# EAGLE design Robot (EAGLE 7.4.0)
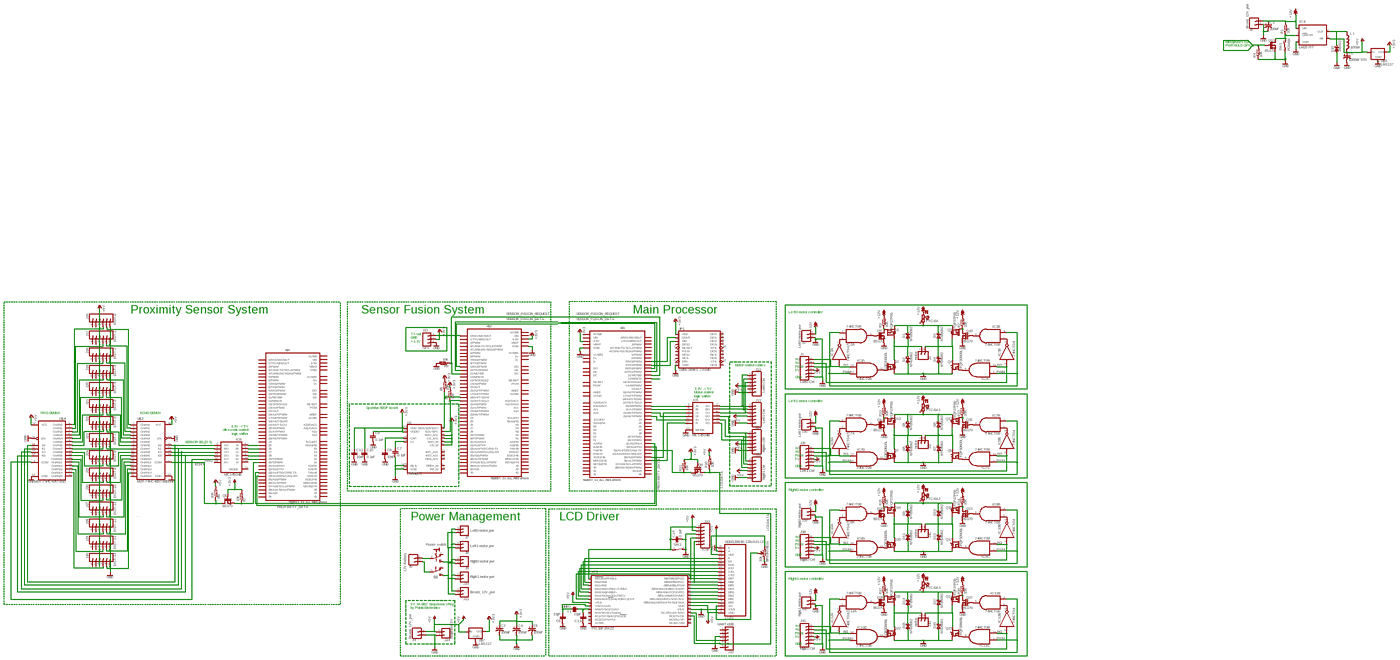
[diagram p0: schematic, sheet 1, overview]
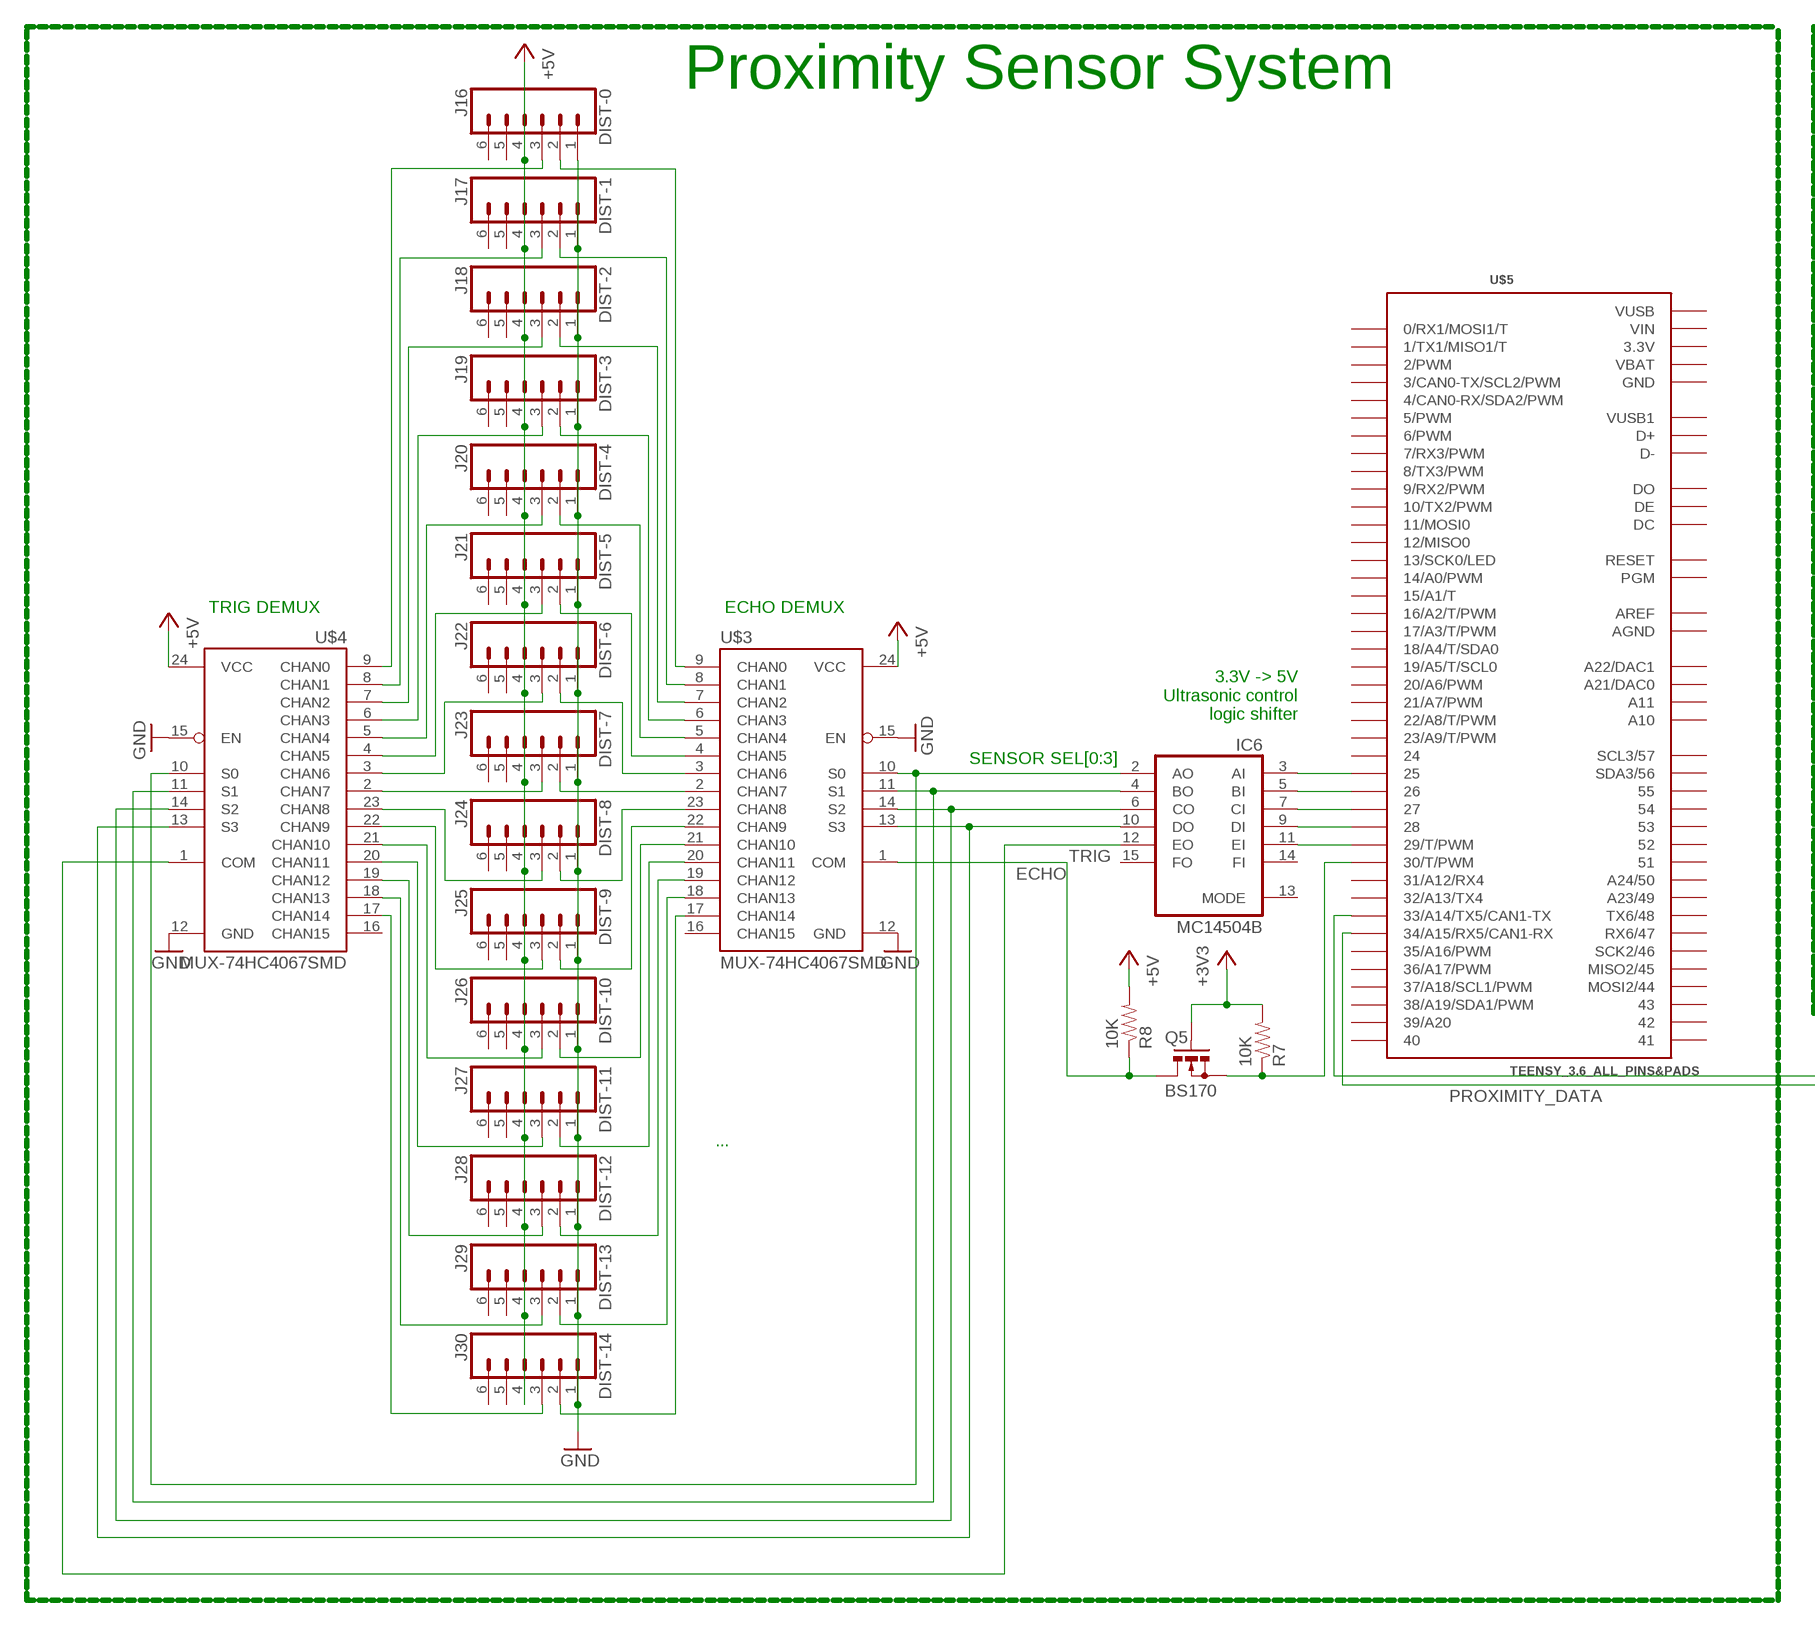
[diagram p1: schematic, sheet 1, part 1 of 4]
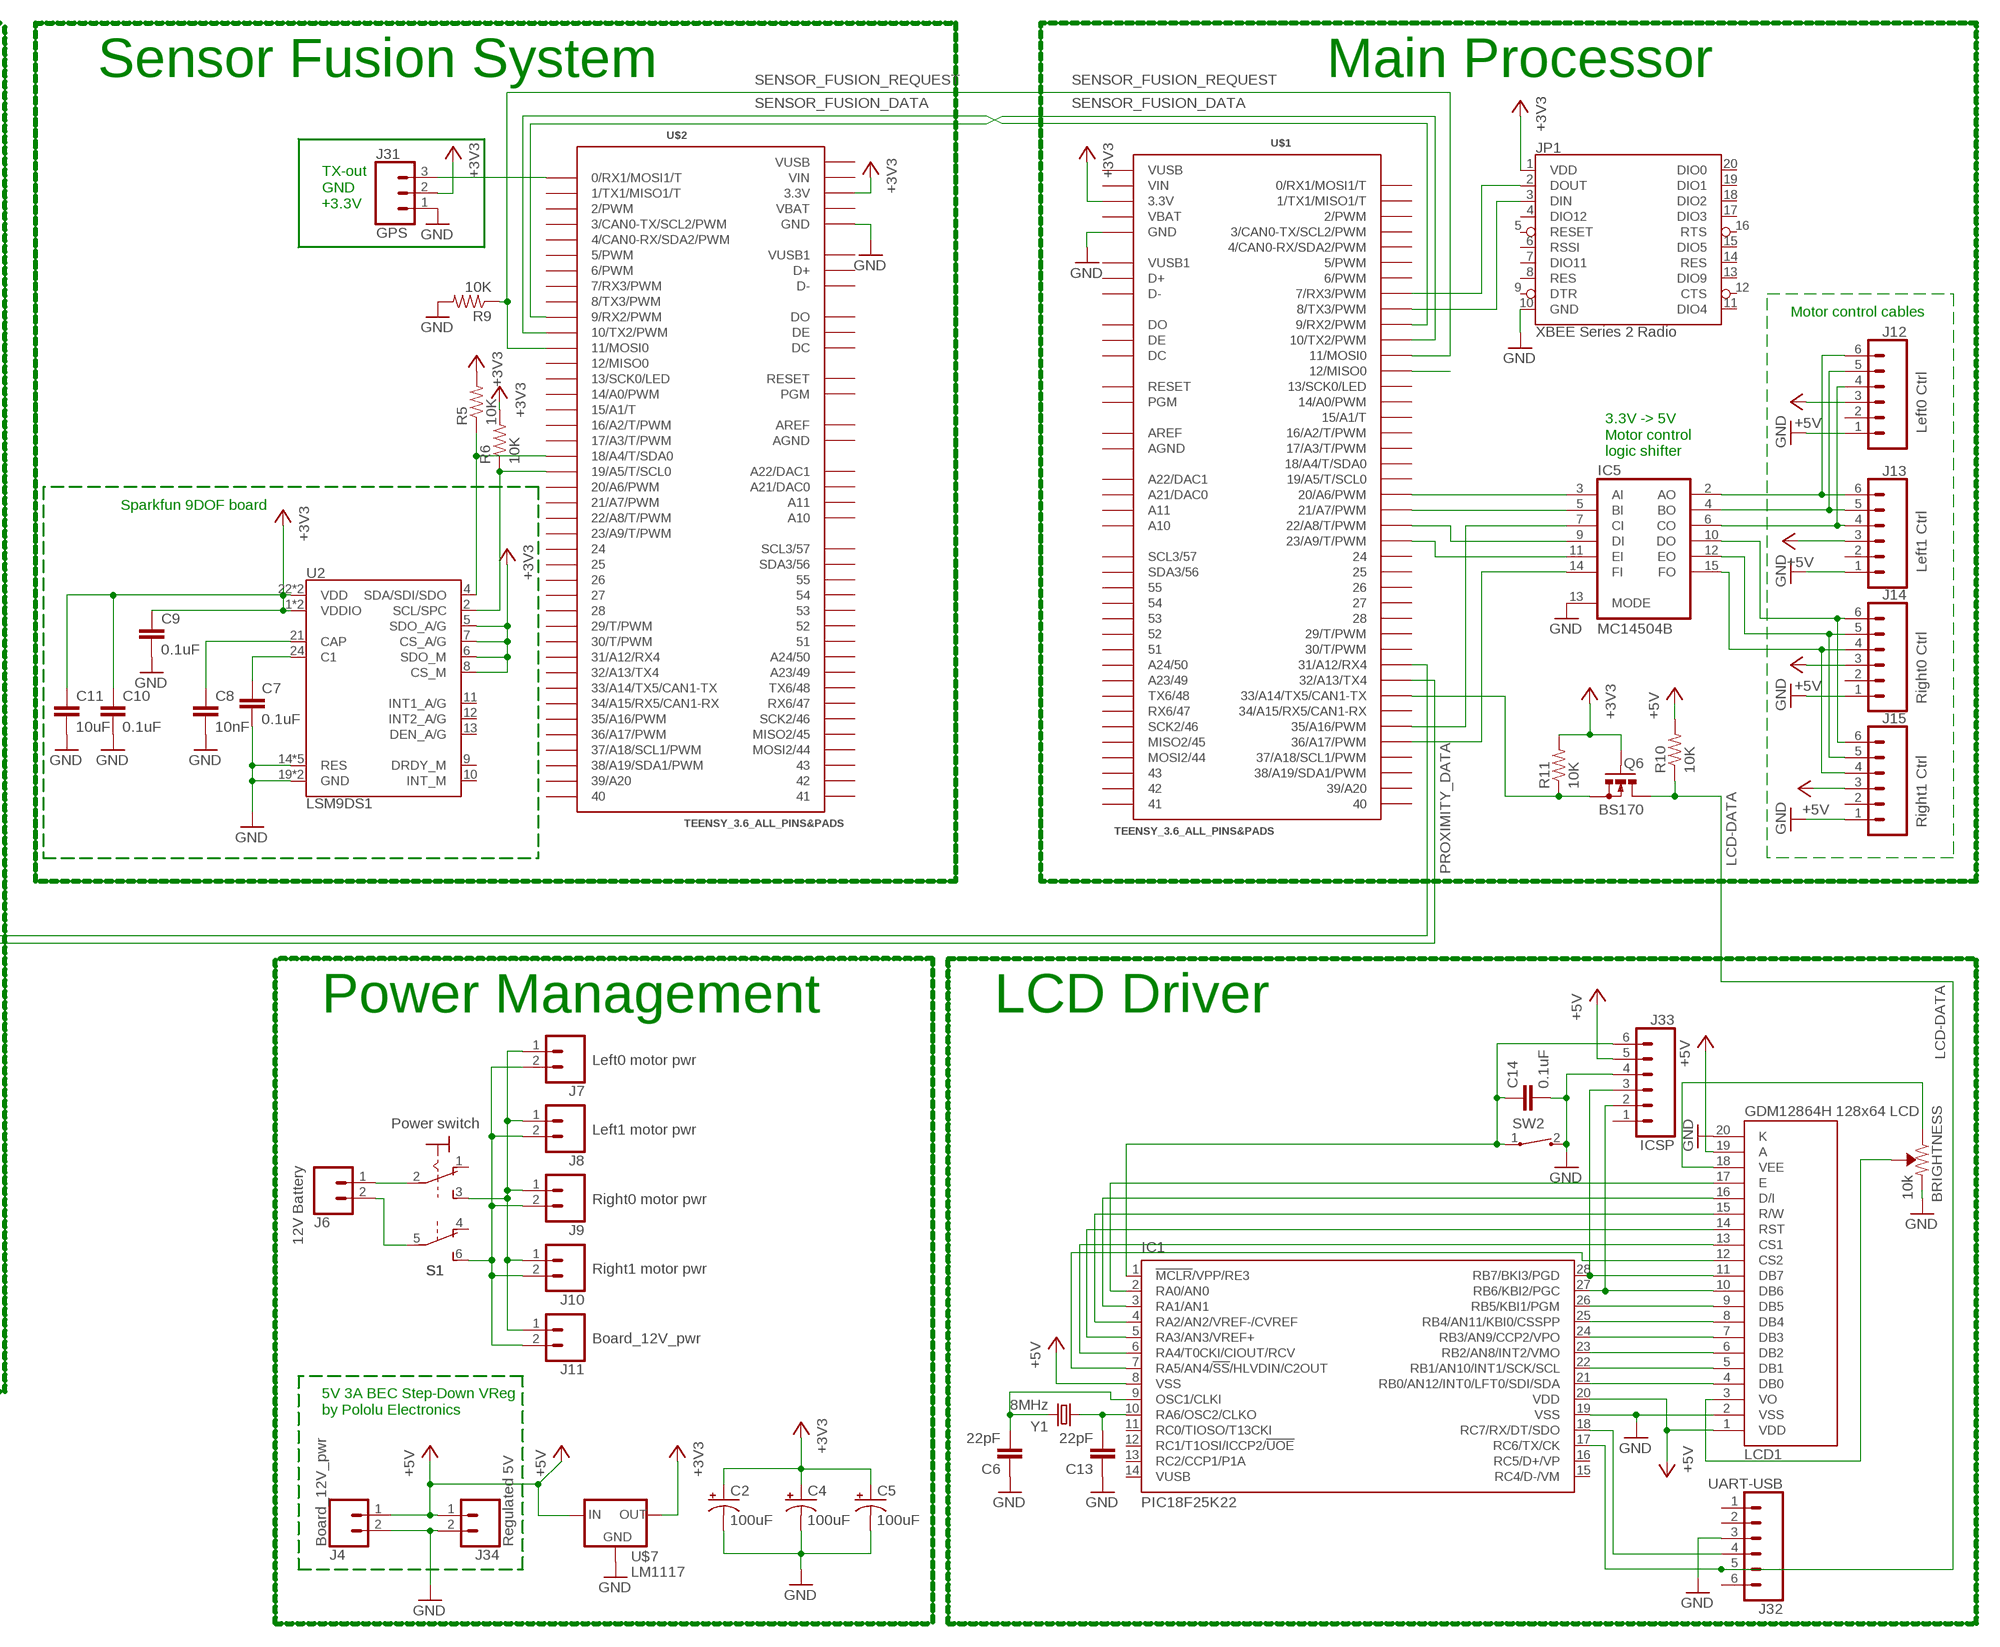
[diagram p2: schematic, sheet 1, part 2 of 4]
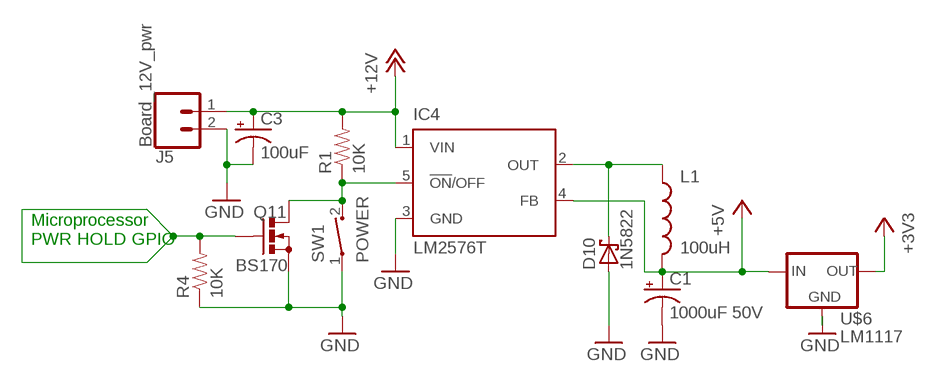
[diagram p3: schematic, sheet 1, part 3 of 4]
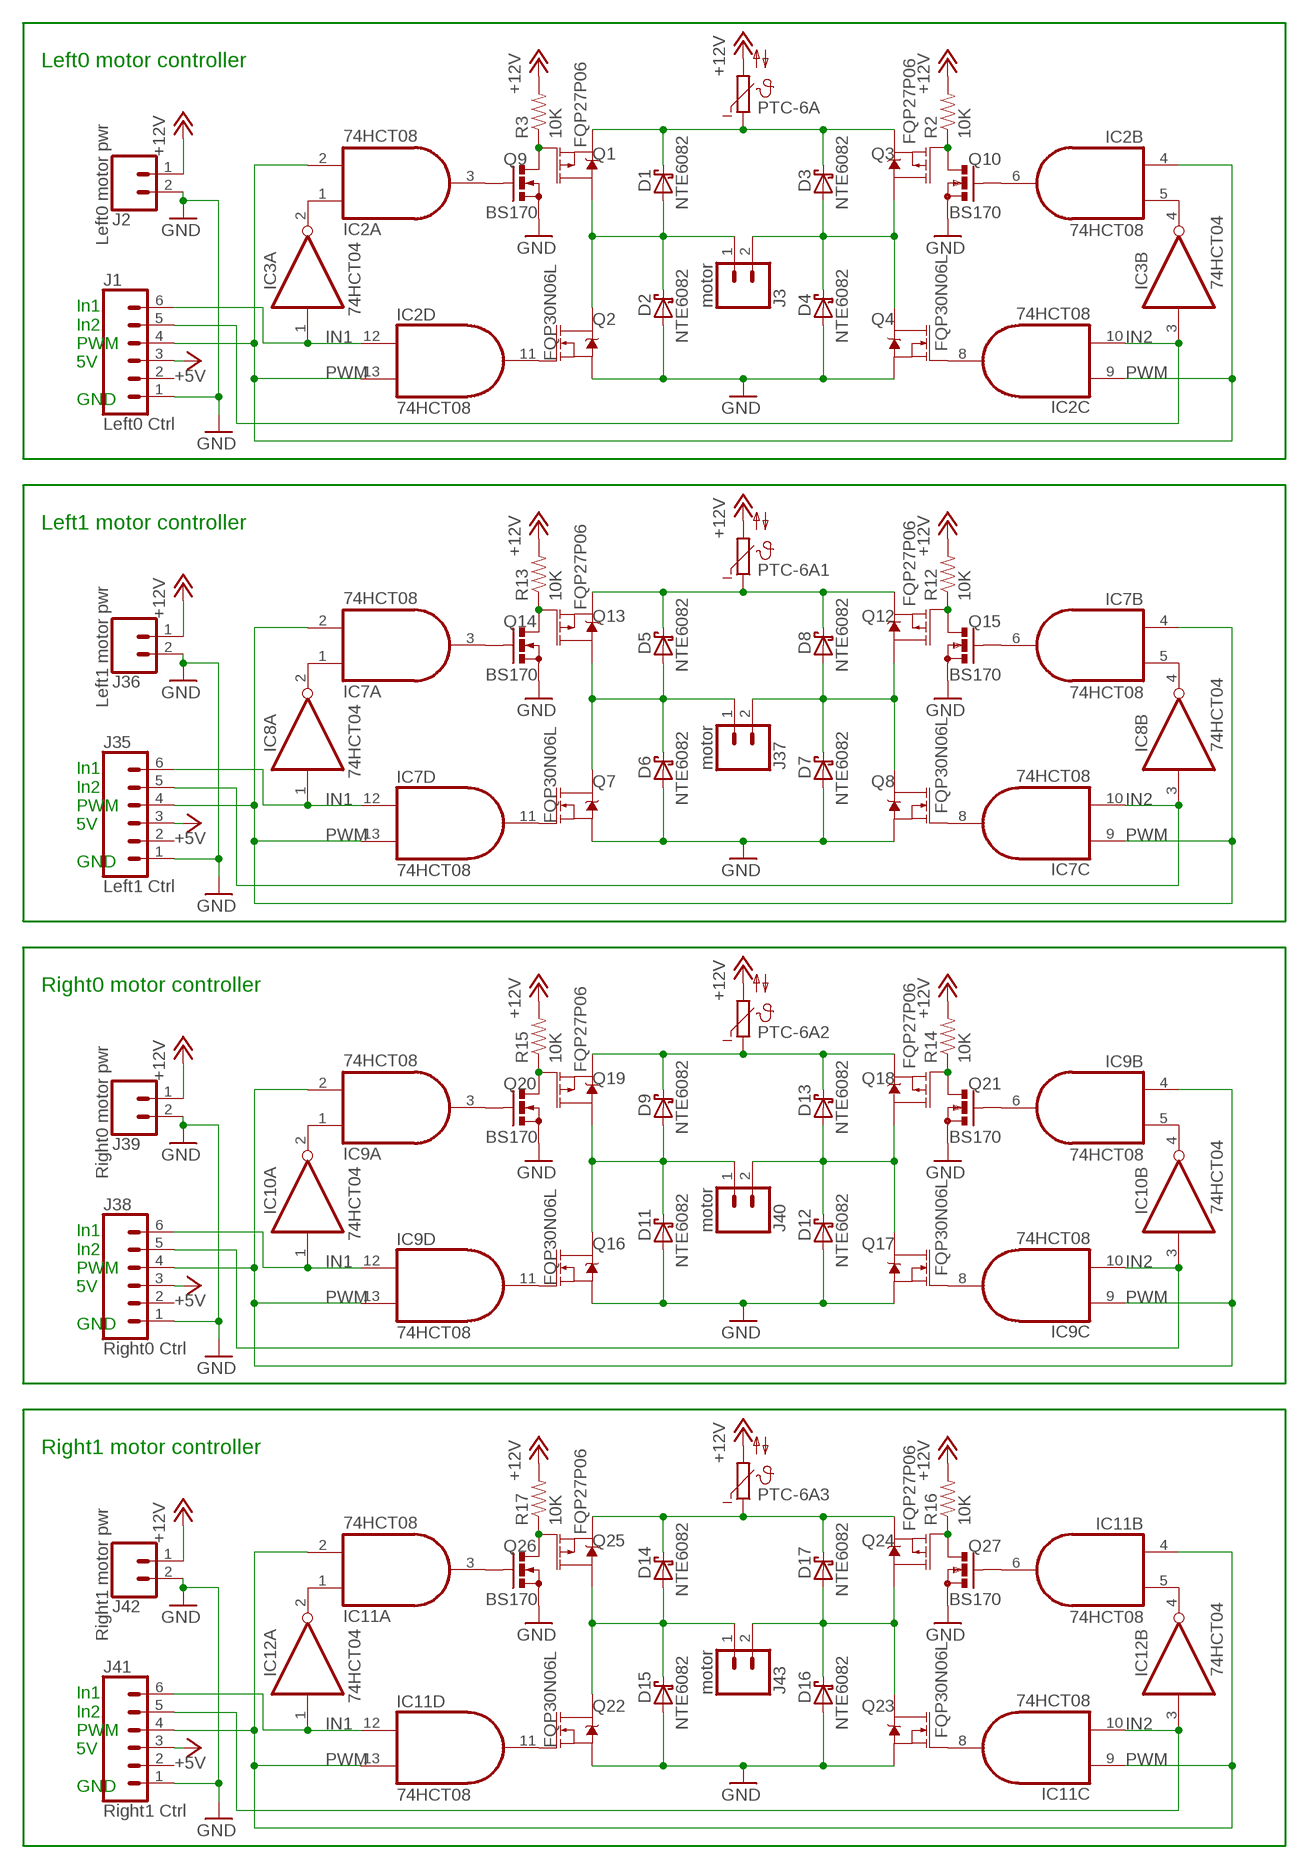
[diagram p4: schematic, sheet 1, part 4 of 4]

## Parts
BRIGHTNESS  10k  TRIMPOT-PTH-10MM-KNOB-1/2W-10%  [TRIMPOT-PTH-3386U]
C1  1000uF 50V  1000UF-RADIAL-5MM-35V-20%-KIT  [CPOL-RADIAL-5MM-10MM-KIT]
C2  100uF  100UF-POLAR-RADIAL-2.5MM-25V-20%  [CPOL-RADIAL-2.5MM-6.5MM]
C3  100uF  100UF-POLAR-RADIAL-2.5MM-25V-20%  [CPOL-RADIAL-2.5MM-6.5MM]
C4  100uF  100UF-POLAR-RADIAL-2.5MM-25V-20%  [CPOL-RADIAL-2.5MM-6.5MM]
C5  100uF  100UF-POLAR-RADIAL-2.5MM-25V-20%  [CPOL-RADIAL-2.5MM-6.5MM]
C6  22pF  CAPEZ  [CAP-PTH-SMALLEZ]
C7  0.1uF  CAPEZ  [CAP-PTH-SMALLEZ]
C8  10nF  CAPEZ  [CAP-PTH-SMALLEZ]
C9  0.1uF  CAPEZ  [CAP-PTH-SMALLEZ]
C10  0.1uF  CAPEZ  [CAP-PTH-SMALLEZ]
C11  10uF  CAPEZ  [CAP-PTH-SMALLEZ]
C13  22pF  CAPEZ  [CAP-PTH-SMALLEZ]
C14  0.1uF  CAPEZ  [CAP-PTH-SMALLEZ]
D1  NTE6082  FES08AT  [DO220S]
D2  NTE6082  FES08AT  [DO220S]
D3  NTE6082  FES08AT  [DO220S]
D4  NTE6082  FES08AT  [DO220S]
D5  NTE6082  FES08AT  [DO220S]
D6  NTE6082  FES08AT  [DO220S]
D7  NTE6082  FES08AT  [DO220S]
D8  NTE6082  FES08AT  [DO220S]
D9  NTE6082  FES08AT  [DO220S]
D10  1N5822  1N5908  [C4111-15]
D11  NTE6082  FES08AT  [DO220S]
D12  NTE6082  FES08AT  [DO220S]
D13  NTE6082  FES08AT  [DO220S]
D14  NTE6082  FES08AT  [DO220S]
D15  NTE6082  FES08AT  [DO220S]
D16  NTE6082  FES08AT  [DO220S]
D17  NTE6082  FES08AT  [DO220S]
IC1  PIC18F25K22  PIC18F2550_28DIP  [DIL28-3]
IC2  74HCT08  74ALS08N  [DIL14]
IC3  74HCT04  74ALS04N  [DIL14]
IC4  LM2576T  LM2596T  [T05D]
IC5  MC14504B  4504N  [DIL16]
IC6  MC14504B  4504N  [DIL16]
IC7  74HCT08  74ALS08N  [DIL14]
IC8  74HCT04  74ALS04N  [DIL14]
IC9  74HCT08  74ALS08N  [DIL14]
IC10  74HCT04  74ALS04N  [DIL14]
IC11  74HCT08  74ALS08N  [DIL14]
IC12  74HCT04  74ALS04N  [DIL14]
J1  Left0 Ctrl  CONN_06POLAR  [MOLEX-1X6]
J2  Left0 motor pwr  CONN_023.5MM  [SCREWTERMINAL-3.5MM-2]
J3  motor  CONN_023.5MM  [SCREWTERMINAL-3.5MM-2]
J4  Board_12V_pwr  CONN_023.5MM  [SCREWTERMINAL-3.5MM-2]
J5  Board_12V_pwr  CONN_023.5MM  [SCREWTERMINAL-3.5MM-2]
J6  12V Battery  CONN_023.5MM  [SCREWTERMINAL-3.5MM-2]
J7  Left0 motor pwr  CONN_023.5MM  [SCREWTERMINAL-3.5MM-2]
J8  Left1 motor pwr  CONN_023.5MM  [SCREWTERMINAL-3.5MM-2]
J9  Right0 motor pwr  CONN_023.5MM  [SCREWTERMINAL-3.5MM-2]
J10  Right1 motor pwr  CONN_023.5MM  [SCREWTERMINAL-3.5MM-2]
J11  Board_12V_pwr  CONN_023.5MM  [SCREWTERMINAL-3.5MM-2]
J12  Left0 Ctrl  CONN_06POLAR  [MOLEX-1X6]
J13  Left1 Ctrl  CONN_06POLAR  [MOLEX-1X6]
J14  Right0 Ctrl  CONN_06POLAR  [MOLEX-1X6]
J15  Right1 Ctrl  CONN_06POLAR  [MOLEX-1X6]
J16  DIST-0  CONN_06POLAR  [MOLEX-1X6]
J17  DIST-1  CONN_06POLAR  [MOLEX-1X6]
J18  DIST-2  CONN_06POLAR  [MOLEX-1X6]
J19  DIST-3  CONN_06POLAR  [MOLEX-1X6]
J20  DIST-4  CONN_06POLAR  [MOLEX-1X6]
J21  DIST-5  CONN_06POLAR  [MOLEX-1X6]
J22  DIST-6  CONN_06POLAR  [MOLEX-1X6]
J23  DIST-7  CONN_06POLAR  [MOLEX-1X6]
J24  DIST-8  CONN_06POLAR  [MOLEX-1X6]
J25  DIST-9  CONN_06POLAR  [MOLEX-1X6]
J26  DIST-10  CONN_06POLAR  [MOLEX-1X6]
J27  DIST-11  CONN_06POLAR  [MOLEX-1X6]
J28  DIST-12  CONN_06POLAR  [MOLEX-1X6]
J29  DIST-13  CONN_06POLAR  [MOLEX-1X6]
J30  DIST-14  CONN_06POLAR  [MOLEX-1X6]
J31  GPS  CONN_03  [1X03]
J32  UART-USB  CONN_06POLAR  [MOLEX-1X6]
J33  ICSP  CONN_06POLAR  [MOLEX-1X6]
J34  Regulated 5V  CONN_023.5MM  [SCREWTERMINAL-3.5MM-2]
J35  Left1 Ctrl  CONN_06POLAR  [MOLEX-1X6]
J36  Left1 motor pwr  CONN_023.5MM  [SCREWTERMINAL-3.5MM-2]
J37  motor  CONN_023.5MM  [SCREWTERMINAL-3.5MM-2]
J38  Right0 Ctrl  CONN_06POLAR  [MOLEX-1X6]
J39  Right0 motor pwr  CONN_023.5MM  [SCREWTERMINAL-3.5MM-2]
J40  motor  CONN_023.5MM  [SCREWTERMINAL-3.5MM-2]
J41  Right1 Ctrl  CONN_06POLAR  [MOLEX-1X6]
J42  Right1 motor pwr  CONN_023.5MM  [SCREWTERMINAL-3.5MM-2]
J43  motor  CONN_023.5MM  [SCREWTERMINAL-3.5MM-2]
JP1  XBEE Series 2 Radio  XBEE  [XBEE]
L1  100uH  INDUCTORAXIAL-0.6  [AXIAL-0.6]
LCD1  GDM12864H 128x64 LCD  LCD-G12864-FULL  [LCD-G12864]
PTC-6A  NTC644A  [N644A]
PTC-6A1  NTC644A  [N644A]
PTC-6A2  NTC644A  [N644A]
PTC-6A3  NTC644A  [N644A]
Q1  FQP27P06  MOSFET_PCH-NDP6020P  [TO220V]
Q2  FQP30N06L  MOSFET-NCH-FQP30N06L  [TO220V]
Q3  FQP27P06  MOSFET_PCH-NDP6020P  [TO220V]
Q4  FQP30N06L  MOSFET-NCH-FQP30N06L  [TO220V]
Q5  BS170  [SOT54E]
Q6  BS170  [SOT54E]
Q7  FQP30N06L  MOSFET-NCH-FQP30N06L  [TO220V]
Q8  FQP30N06L  MOSFET-NCH-FQP30N06L  [TO220V]
Q9  BS170  [SOT54E]
Q10  BS170  [SOT54E]
Q11  BS170  [SOT54E]
Q12  FQP27P06  MOSFET_PCH-NDP6020P  [TO220V]
Q13  FQP27P06  MOSFET_PCH-NDP6020P  [TO220V]
Q14  BS170  [SOT54E]
Q15  BS170  [SOT54E]
Q16  FQP30N06L  MOSFET-NCH-FQP30N06L  [TO220V]
Q17  FQP30N06L  MOSFET-NCH-FQP30N06L  [TO220V]
Q18  FQP27P06  MOSFET_PCH-NDP6020P  [TO220V]
Q19  FQP27P06  MOSFET_PCH-NDP6020P  [TO220V]
Q20  BS170  [SOT54E]
Q21  BS170  [SOT54E]
Q22  FQP30N06L  MOSFET-NCH-FQP30N06L  [TO220V]
Q23  FQP30N06L  MOSFET-NCH-FQP30N06L  [TO220V]
Q24  FQP27P06  MOSFET_PCH-NDP6020P  [TO220V]
Q25  FQP27P06  MOSFET_PCH-NDP6020P  [TO220V]
Q26  BS170  [SOT54E]
Q27  BS170  [SOT54E]
R1  10K  RESISTORPTH-1/4W  [AXIAL-0.4]
R2  10K  RESISTORPTH-1/4W  [AXIAL-0.4]
R3  10K  RESISTORPTH-1/4W  [AXIAL-0.4]
R4  10K  RESISTORPTH-1/4W  [AXIAL-0.4]
R5  10K  RESISTORPTH-1/4W  [AXIAL-0.4]
R6  10K  RESISTORPTH-1/4W  [AXIAL-0.4]
R7  10K  RESISTORPTH-1/4W  [AXIAL-0.4]
R8  10K  RESISTORPTH-1/4W  [AXIAL-0.4]
R9  10K  RESISTORPTH-1/4W  [AXIAL-0.4]
R10  10K  RESISTORPTH-1/4W  [AXIAL-0.4]
R11  10K  RESISTORPTH-1/4W  [AXIAL-0.4]
R12  10K  RESISTORPTH-1/4W  [AXIAL-0.4]
R13  10K  RESISTORPTH-1/4W  [AXIAL-0.4]
R14  10K  RESISTORPTH-1/4W  [AXIAL-0.4]
R15  10K  RESISTORPTH-1/4W  [AXIAL-0.4]
R16  10K  RESISTORPTH-1/4W  [AXIAL-0.4]
R17  10K  RESISTORPTH-1/4W  [AXIAL-0.4]
S1  Power switch  M9040P2  [M9040P2]
SW1  POWER  CT10-XXXX-A2  [CT10-XXXX-A2]
SW2  CT10-XXXX-A2  [CT10-XXXX-A2]
U2  LSM9DS1  [LGA-24-3.5X3]
U$1  TEENSY_3.6_ALL_PINS&PADS  [TEENSY_3.6_ALL_PINS&PADS]
U$2  TEENSY_3.6_ALL_PINS&PADS  [TEENSY_3.6_ALL_PINS&PADS]
U$3  MUX-74HC4067SMD  [SSOP24]
U$4  MUX-74HC4067SMD  [SSOP24]
U$5  TEENSY_3.6_ALL_PINS&PADS  [TEENSY_3.6_ALL_PINS&PADS]
U$6  LM1117  V_REG_LD1117VXX  [78XXL]
U$7  LM1117  V_REG_LD1117VXX  [78XXL]
Y1  8MHz  CRYSTALHC49UV  [HC49U-V]

## Nets
+3V3: C2.1(+) C4.1(+) C5.1(+) C9.1 C10.1 C11.1 J31.2 JP1.1(VDD) Q5.G Q6.G R5.P$2 R6.P$2 R7.P$2 R11.P$2 U2.1(VDDIO) U2.3(VDDIO) U2.5(SDO_A/G) U2.6(SDO_M) U2.7(CS_A/G) U2.8(CS_M) U2.22(VDD) U2.23(VDD) U$1.3.3V U$1.3.3V2(3.3V) U$1.3.3V3(3.3V) U$1.3.3V4(3.3V) U$2.3.3V U$2.3.3V2(3.3V) U$2.3.3V3(3.3V) U$2.3.3V4(3.3V) U$6.GND(OUT) U$7.GND(OUT)
+5V: C1.+ IC1.8(VSS) IC1.20(VDD) IC4.4(FB) J1.3 J4.1 J12.3 J13.3 J14.3 J15.3 J16.4 J17.4 J18.4 J19.4 J20.4 J21.4 J22.4 J23.4 J24.4 J25.4 J26.4 J27.4 J28.4 J29.4 J30.4 J33.5 J34.1 J35.3 J38.3 J41.3 L1.P$2 LCD1.1(VDD) LCD1.19(A) R8.P$2 R10.P$2 U$3.24(VCC) U$4.24(VCC) U$6.OUT(IN) U$7.OUT(IN)
+12V: C3.1(+) IC4.1(VIN) J2.1 J5.1 J36.1 J39.1 J42.1 PTC-6A1.2 PTC-6A2.2 PTC-6A3.2 PTC-6A.2 R1.P$2 R2.P$2 R3.P$2 R12.P$2 R13.P$2 R14.P$2 R15.P$2 R16.P$2 R17.P$2
ECHO: Q5.D R8.P$1 U$3.1(COM)
GND: BRIGHTNESS.1(CCW) C1.- C2.2(-) C3.2(-) C4.2(-) C5.2(-) C6.1 C7.2 C8.2 C9.2 C10.2 C11.2 C13.1 C14.2 D10.A IC1.19(VSS) IC4.3(GND) IC5.13(MODE) J1.1 J2.2 J4.2 J5.2 J12.1 J13.1 J14.1 J15.1 J16.1 J17.1 J18.1 J19.1 J20.1 J21.1 J22.1 J23.1 J24.1 J25.1 J26.1 J27.1 J28.1 J29.1 J30.1 J31.1 J32.3 J33.4 J34.2 J35.1 J36.2 J38.1 J39.2 J41.1 J42.2 JP1.10(GND) LCD1.2(VSS) LCD1.20(K) Q9.S Q10.S Q11.S Q14.S Q15.S Q20.S Q21.S Q26.S Q27.S R4.P$1 R9.P$2 SW1.1 SW2.2 U2.14(RES) U2.15(RES) U2.16(RES) U2.17(RES) U2.18(RES) U2.19(GND) U2.20(GND) U$1.GND U$1.GND1(GND) U$1.GND2(GND) U$1.GND3(GND) U$1.GND4(GND) U$1.GND5(GND) U$1.GND6(GND) U$2.GND U$2.GND1(GND) U$2.GND2(GND) U$2.GND3(GND) U$2.GND4(GND) U$2.GND5(GND) U$2.GND6(GND) U$3.12(GND) U$3.15(EN) U$4.12(GND) U$4.15(EN) U$6.IN(GND) U$7.IN(GND)
IN1: IC2.12(D:I0) IC3.1(A:I) IC7.12(D:I0) IC8.1(A:I) IC9.12(D:I0) IC10.1(A:I) IC11.12(D:I0) IC12.1(A:I) J1.6 J35.6 J38.6 J41.6
IN2: IC2.10(C:I1) IC3.3(B:I) IC7.10(C:I1) IC8.3(B:I) IC9.10(C:I1) IC10.3(B:I) IC11.10(C:I1) IC12.3(B:I) J1.5 J35.5 J38.5 J41.5
LCD-DATA: IC1.17(RC6/TX/CK) J32.5 Q6.D R10.P$1
N$1: IC2.3(A:O) Q9.G
N$2: IC2.6(B:O) Q10.G
N$3: Q6.S R11.P$1 U$1.33/A14(33/A14/TX5/CAN1-TX)
N$4: IC5.11(EI) U$1.23/A9(23/A9/T/PWM)
N$6: Q11.G R4.P$2
N$7: IC5.9(DI) U$1.22/A8(22/A8/T/PWM)
N$8: J19.2 U$3.6(CHAN3)
N$9: IC4.5(!ON!/OFF) Q11.D R1.P$1 SW1.2
N$10: U$1.12(12/MISO0)
N$11: D10.C IC4.2(OUT) L1.P$1
N$12: JP1.2(DOUT) U$1.7(7/RX3/PWM)
N$13: R6.P$1 U2.2(SCL/SPC) U$2.19/A5(19/A5/T/SCL0)
N$14: R5.P$1 U2.4(SDA/SDI/SDO) U$2.18/A4(18/A4/T/SDA0)
N$15: J31.3 U$2.0(0/RX1/MOSI1/T)
N$16: IC5.3(AI) U$1.20/A6(20/A6/PWM)
N$18: J6.1 S1.2(1:P)
N$19: J6.2 S1.5(2:P)
N$20: J7.1 J8.1 J9.1 J10.1 J11.1 S1.3(1:S)
N$21: IC5.2(AO) J12.6 J13.6
N$22: IC1.2(RA0/AN0) LCD1.17(E)
N$23: IC1.3(RA1/AN1) LCD1.16(D/I)
N$24: IC1.5(RA3/AN3/VREF+) LCD1.14(RST)
N$25: IC1.21(RB0/AN12/INT0/LFT0/SDI/SDA) LCD1.4(DB0)
N$26: IC1.22(RB1/AN10/INT1/SCK/SCL) LCD1.5(DB1)
N$27: IC1.23(RB2/AN8/INT2/VMO) LCD1.6(DB2)
N$28: IC1.24(RB3/AN9/CCP2/VPO) LCD1.7(DB3)
N$29: IC1.25(RB4/AN11/KBI0/CSSPP) LCD1.8(DB4)
N$30: IC1.26(RB5/KBI1/PGM) LCD1.9(DB5)
N$31: IC1.27(RB6/KBI2/PGC) J33.2 LCD1.10(DB6)
N$32: IC1.28(RB7/BKI3/PGD) J33.3 LCD1.11(DB7)
N$33: IC1.4(RA2/AN2/VREF-/CVREF) LCD1.15(R/W)
N$34: IC1.6(RA4/T0CKI/CIOUT/RCV) LCD1.13(CS1)
N$35: IC1.7(RA5/AN4/!SS!/HLVDIN/C2OUT) LCD1.12(CS2)
N$36: D1.A D2.C J3.1 Q1.2(D) Q2.2(D)
N$37: D3.A D4.C J3.2 Q3.2(D) Q4.2(D)
N$38: D1.C D3.C PTC-6A.1 Q1.3(S) Q3.3(S)
N$39: IC2.11(D:O) Q2.1(G)
N$40: Q3.1(G) Q10.D R2.P$1
N$41: D2.A D4.A D6.A D7.A D11.A D12.A D15.A D16.A Q2.3(S) Q4.3(S) Q7.3(S) Q8.3(S) Q16.3(S) Q17.3(S) Q22.3(S) Q23.3(S) ; supply symbol labelled GND
N$42: IC2.8(C:O) Q4.1(G)
N$43: Q1.1(G) Q9.D R3.P$1
N$44: J7.2 J8.2 J9.2 J10.2 J11.2 S1.6(2:S)
N$45: BRIGHTNESS.2(WIPER) LCD1.3(VO)
N$46: JP1.3(DIN) U$1.8(8/TX3/PWM)
N$47: BRIGHTNESS.3(CW) LCD1.18(VEE)
N$48: IC5.4(BO) J12.5 J13.5
N$49: D5.A D6.C J37.1 Q7.2(D) Q13.2(D)
N$50: IC2.1(A:I0) IC3.2(A:O)
N$51: IC2.5(B:I1) IC3.4(B:O)
N$52: U$1.10(10/TX2/PWM) U$2.9(9/RX2/PWM)
N$53: IC5.6(CO) J12.4 J13.4
N$54: IC5.10(DO) J14.6 J15.6
N$55: IC5.12(EO) J14.5 J15.5
N$56: IC5.15(FO) J14.4 J15.4
N$57: J20.2 U$3.5(CHAN4)
N$58: J16.2 U$3.9(CHAN0)
N$59: J17.2 U$3.8(CHAN1)
N$60: J17.3 U$4.8(CHAN1)
N$61: J27.3 U$4.20(CHAN11)
N$62: J18.3 U$4.7(CHAN2)
N$63: J16.3 U$4.9(CHAN0)
N$64: J19.3 U$4.6(CHAN3)
N$65: J20.3 U$4.5(CHAN4)
N$66: J22.2 U$3.3(CHAN6)
N$67: J23.2 U$3.2(CHAN7)
N$68: J21.2 U$3.4(CHAN5)
N$69: J22.3 U$4.3(CHAN6)
N$70: J23.3 U$4.2(CHAN7)
N$71: J25.2 U$3.22(CHAN9)
N$72: J26.2 U$3.21(CHAN10)
N$73: J18.2 U$3.7(CHAN2)
N$74: J25.3 U$4.22(CHAN9)
N$75: J26.3 U$4.21(CHAN10)
N$76: J28.2 U$3.19(CHAN12)
N$77: J29.2 U$3.18(CHAN13)
N$78: IC6.2(AO) U$3.10(S0) U$4.10(S0)
N$79: J28.3 U$4.19(CHAN12)
N$80: J29.3 U$4.18(CHAN13)
N$81: J24.3 U$4.23(CHAN8)
N$82: J24.2 U$3.23(CHAN8)
N$83: IC6.4(BO) U$3.11(S1) U$4.11(S1)
N$84: J30.3 U$4.17(CHAN14)
N$85: J27.2 U$3.20(CHAN11)
N$86: IC6.6(CO) U$3.14(S2) U$4.14(S2)
N$87: IC6.10(DO) U$3.13(S3) U$4.13(S3)
N$88: J30.2 U$3.17(CHAN14)
N$89: Q5.S R7.P$1 U$5.30(30/T/PWM)
N$90: J21.3 U$4.4(CHAN5)
N$91: IC6.3(AI) U$5.25
N$92: C7.1 U2.24(C1)
N$93: IC6.5(BI) U$5.26
N$94: C8.1 U2.21(CAP)
N$95: IC6.7(CI) U$5.27
N$96: IC6.9(DI) U$5.28
N$97: IC6.11(EI) U$5.29(29/T/PWM)
N$99: IC5.5(BI) U$1.21/A7(21/A7/PWM)
N$100: IC5.7(CI) U$1.35/A16(35/A16/PWM)
N$101: IC5.14(FI) U$1.36/A17(36/A17/PWM)
N$102: D7.C D8.A J37.2 Q8.2(D) Q12.2(D)
N$103: C6.2 IC1.9(OSC1/CLKI) Y1.2
N$104: D5.C D8.C PTC-6A1.1 Q12.3(S) Q13.3(S)
N$105: C14.1 IC1.1(!MCLR!/VPP/RE3) J33.6 SW2.1
N$106: C13.2 IC1.10(RA6/OSC2/CLKO) Y1.1
N$107: IC1.18(RC7/RX/DT/SDO) J32.4
N$108: Q12.1(G) Q15.D R12.P$1
N$109: Q13.1(G) Q14.D R13.P$1
N$110: IC7.11(D:O) Q7.1(G)
N$111: IC7.8(C:O) Q8.1(G)
N$112: IC7.1(A:I0) IC8.2(A:O)
N$113: IC7.5(B:I1) IC8.4(B:O)
N$114: IC7.3(A:O) Q14.G
N$115: IC7.6(B:O) Q15.G
N$117: D9.A D11.C J40.1 Q16.2(D) Q19.2(D)
N$118: D12.C D13.A J40.2 Q17.2(D) Q18.2(D)
N$119: D9.C D13.C PTC-6A2.1 Q18.3(S) Q19.3(S)
N$120: Q18.1(G) Q21.D R14.P$1
N$121: Q19.1(G) Q20.D R15.P$1
N$122: IC9.11(D:O) Q16.1(G)
N$123: IC9.8(C:O) Q17.1(G)
N$124: IC9.1(A:I0) IC10.2(A:O)
N$125: IC9.5(B:I1) IC10.4(B:O)
N$126: IC9.3(A:O) Q20.G
N$127: IC9.6(B:O) Q21.G
N$129: D14.A D15.C J43.1 Q22.2(D) Q25.2(D)
N$130: D16.C D17.A J43.2 Q23.2(D) Q24.2(D)
N$131: D14.C D17.C PTC-6A3.1 Q24.3(S) Q25.3(S)
N$132: Q24.1(G) Q27.D R16.P$1
N$133: Q25.1(G) Q26.D R17.P$1
N$134: IC11.11(D:O) Q22.1(G)
N$135: IC11.8(C:O) Q23.1(G)
N$136: IC11.1(A:I0) IC12.2(A:O)
N$137: IC11.5(B:I1) IC12.4(B:O)
N$138: IC11.3(A:O) Q26.G
N$139: IC11.6(B:O) Q27.G
N$141: U$1.31/A12(31/A12/RX4) U$5.33/A14(33/A14/TX5/CAN1-TX)
PROXIMITY_DATA: U$1.32/A13(32/A13/TX4) U$5.34/A15(34/A15/RX5/CAN1-RX)
PWM: IC2.2(A:I1) IC2.4(B:I0) IC2.9(C:I0) IC2.13(D:I1) IC7.2(A:I1) IC7.4(B:I0) IC7.9(C:I0) IC7.13(D:I1) IC9.2(A:I1) IC9.4(B:I0) IC9.9(C:I0) IC9.13(D:I1) IC11.2(A:I1) IC11.4(B:I0) IC11.9(C:I0) IC11.13(D:I1) J1.4 J35.4 J38.4 J41.4
SENSOR_FUSION_DATA: U$1.9(9/RX2/PWM) U$2.10(10/TX2/PWM)
SENSOR_FUSION_REQUEST: R9.P$1 U$1.11(11/MOSI0) U$2.11(11/MOSI0)
TRIG: IC6.12(EO) U$4.1(COM)
Unconnected: IC1.11(RC0/TIOSO/T13CKI) IC1.12(RC1/T1OSI/ICCP2/!UOE) IC1.13(RC2/CCP1/P1A) IC1.14(VUSB) IC1.15(RC4/D-/VM) IC1.16(RC5/D+/VP) IC3.5(C:I) IC3.6(C:O) IC3.8(D:O) IC3.9(D:I) IC3.10(E:O) IC3.11(E:I) IC3.12(F:O) IC3.13(F:I) IC6.13(MODE) IC6.14(FI) IC6.15(FO) IC8.5(C:I) IC8.6(C:O) IC8.8(D:O) IC8.9(D:I) IC8.10(E:O) IC8.11(E:I) IC8.12(F:O) IC8.13(F:I) IC10.5(C:I) IC10.6(C:O) IC10.8(D:O) IC10.9(D:I) IC10.10(E:O) IC10.11(E:I) IC10.12(F:O) IC10.13(F:I) IC12.5(C:I) IC12.6(C:O) IC12.8(D:O) IC12.9(D:I) IC12.10(E:O) IC12.11(E:I) IC12.12(F:O) IC12.13(F:I) J1.2 J12.2 J13.2 J14.2 J15.2 J16.5 J16.6 J17.5 J17.6 J18.5 J18.6 J19.5 J19.6 J20.5 J20.6 J21.5 J21.6 J22.5 J22.6 J23.5 J23.6 J24.5 J24.6 J25.5 J25.6 J26.5 J26.6 J27.5 J27.6 J28.5 J28.6 J29.5 J29.6 J30.5 J30.6 J32.1 J32.2 J32.6 J33.1 J35.2 J38.2 J41.2 JP1.4(DIO12) JP1.5(RESET) JP1.6(RSSI) JP1.7(DIO11) JP1.8(RES) JP1.9(DTR) JP1.11(DIO4) JP1.12(CTS) JP1.13(DIO9) JP1.14(RES) JP1.15(DIO5) JP1.16(RTS) JP1.17(DIO3) JP1.18(DIO2) JP1.19(DIO1) JP1.20(DIO0) S1.1(1:O) S1.4(2:O) U2.9(DRDY_M) U2.10(INT_M) U2.11(INT1_A/G) U2.12(INT2_A/G) U2.13(DEN_A/G) U$1.0(0/RX1/MOSI1/T) U$1.1(1/TX1/MISO1/T) U$1.2(2/PWM) U$1.3(3/CAN0-TX/SCL2/PWM) U$1.4(4/CAN0-RX/SDA2/PWM) U$1.5(5/PWM) U$1.6(6/PWM) U$1.13(13/SCK0/LED) U$1.14/A0(14/A0/PWM) U$1.15/A1(15/A1/T) U$1.16/A2(16/A2/T/PWM) U$1.17/A3(17/A3/T/PWM) U$1.18/A4(18/A4/T/SDA0) U$1.19/A5(19/A5/T/SCL0) U$1.24 U$1.25 U$1.26 U$1.27 U$1.28 U$1.29(29/T/PWM) U$1.30(30/T/PWM) U$1.34/A15(34/A15/RX5/CAN1-RX) U$1.37/A18(37/A18/SCL1/PWM) U$1.38/A19(38/A19/SDA1/PWM) U$1.39/A20 U$1.40 U$1.41 U$1.42 U$1.43 U$1.44(MOSI2/44) U$1.45(MISO2/45) U$1.46(SCK2/46) U$1.47(RX6/47) U$1.48(TX6/48) U$1.49(A23/49) U$1.50(A24/50) U$1.51 U$1.52 U$1.53 U$1.54 U$1.55 U$1.56(SDA3/56) U$1.57(SCL3/57) U$1.A10 U$1.A11 U$1.A21(A21/DAC0) U$1.A22(A22/DAC1) U$1.D+ U$1.D- U$1.DC U$1.DE U$1.DO U$1.PGM U$1.RESET U$2.1(1/TX1/MISO1/T) U$2.2(2/PWM) U$2.3(3/CAN0-TX/SCL2/PWM) U$2.4(4/CAN0-RX/SDA2/PWM) U$2.5(5/PWM) U$2.6(6/PWM) U$2.7(7/RX3/PWM) U$2.8(8/TX3/PWM) U$2.12(12/MISO0) U$2.13(13/SCK0/LED) U$2.14/A0(14/A0/PWM) U$2.15/A1(15/A1/T) U$2.16/A2(16/A2/T/PWM) U$2.17/A3(17/A3/T/PWM) U$2.20/A6(20/A6/PWM) U$2.21/A7(21/A7/PWM) U$2.22/A8(22/A8/T/PWM) U$2.23/A9(23/A9/T/PWM) U$2.24 U$2.25 U$2.26 U$2.27 U$2.28 U$2.29(29/T/PWM) U$2.30(30/T/PWM) U$2.31/A12(31/A12/RX4) U$2.32/A13(32/A13/TX4) U$2.33/A14(33/A14/TX5/CAN1-TX) U$2.34/A15(34/A15/RX5/CAN1-RX) U$2.35/A16(35/A16/PWM) U$2.36/A17(36/A17/PWM) U$2.37/A18(37/A18/SCL1/PWM) U$2.38/A19(38/A19/SDA1/PWM) U$2.39/A20 U$2.40 U$2.41 U$2.42 U$2.43 U$2.44(MOSI2/44) U$2.45(MISO2/45) U$2.46(SCK2/46) U$2.47(RX6/47) U$2.48(TX6/48) U$2.49(A23/49) U$2.50(A24/50) U$2.51 U$2.52 U$2.53 U$2.54 U$2.55 U$2.56(SDA3/56) U$2.57(SCL3/57) U$2.A10 U$2.A11 U$2.A21(A21/DAC0) U$2.A22(A22/DAC1) U$2.D+ U$2.D- U$2.DC U$2.DE U$2.DO U$2.PGM U$2.RESET U$3.16(CHAN15) U$4.16(CHAN15) U$5.0(0/RX1/MOSI1/T) U$5.1(1/TX1/MISO1/T) U$5.2(2/PWM) U$5.3(3/CAN0-TX/SCL2/PWM) U$5.4(4/CAN0-RX/SDA2/PWM) U$5.5(5/PWM) U$5.6(6/PWM) U$5.7(7/RX3/PWM) U$5.8(8/TX3/PWM) U$5.9(9/RX2/PWM) U$5.10(10/TX2/PWM) U$5.11(11/MOSI0) U$5.12(12/MISO0) U$5.13(13/SCK0/LED) U$5.14/A0(14/A0/PWM) U$5.15/A1(15/A1/T) U$5.16/A2(16/A2/T/PWM) U$5.17/A3(17/A3/T/PWM) U$5.18/A4(18/A4/T/SDA0) U$5.19/A5(19/A5/T/SCL0) U$5.20/A6(20/A6/PWM) U$5.21/A7(21/A7/PWM) U$5.22/A8(22/A8/T/PWM) U$5.23/A9(23/A9/T/PWM) U$5.24 U$5.31/A12(31/A12/RX4) U$5.32/A13(32/A13/TX4) U$5.35/A16(35/A16/PWM) U$5.36/A17(36/A17/PWM) U$5.37/A18(37/A18/SCL1/PWM) U$5.38/A19(38/A19/SDA1/PWM) U$5.39/A20 U$5.40 U$5.41 U$5.42 U$5.43 U$5.44(MOSI2/44) U$5.45(MISO2/45) U$5.46(SCK2/46) U$5.47(RX6/47) U$5.48(TX6/48) U$5.49(A23/49) U$5.50(A24/50) U$5.51 U$5.52 U$5.53 U$5.54 U$5.55 U$5.56(SDA3/56) U$5.57(SCL3/57) U$5.A10 U$5.A11 U$5.A21(A21/DAC0) U$5.A22(A22/DAC1) U$5.D+ U$5.D- U$5.DC U$5.DE U$5.DO U$5.PGM U$5.RESET

## Notes on the sheet
- Microprocessor
  PWR HOLD GPIO
- Proximity Sensor System | Sensor Fusion System | Main Processor | Left0 motor controller
- TX-out
  GND
  +3.3V
- Motor control cables
- In1
  In2
  PWM
  5V
  
  GND
- 3.3V -> 5V
  Motor control
  logic shifter
- Left1 motor controller
- Sparkfun 9DOF board
- TRIG DEMUX | ECHO DEMUX
- 3.3V -> 5V
  Ultrasonic control
  logic shifter
- SENSOR SEL[0:3]
- In1
  In2
  PWM
  5V
  
  GND
- Right0 motor controller
- ...
- Power Management | LCD Driver
- In1
  In2
  PWM
  5V
  
  GND
- Right1 motor controller
- 5V 3A BEC Step-Down VReg
  by Pololu Electronics
- In1
  In2
  PWM
  5V
  
  GND

## Power pins joined to a net without a drawn wire
3.3V: U$5.3.3V U$5.3.3V2(3.3V) U$5.3.3V3(3.3V) U$5.3.3V4(3.3V)
AGND: U$1.AGND U$2.AGND U$5.AGND
AREF: U$1.AREF U$2.AREF U$5.AREF
N$41: IC2.7(P:GND) IC3.7(P:GND) IC5.8(GND) IC6.8(GND) IC7.7(P:GND) IC8.7(P:GND) IC9.7(P:GND) IC10.7(P:GND) IC11.7(P:GND) IC12.7(P:GND) U$5.GND U$5.GND1(GND) U$5.GND2(GND) U$5.GND3(GND) U$5.GND4(GND) U$5.GND5(GND) U$5.GND6(GND)
VBAT: U$1.VBAT U$2.VBAT U$5.VBAT
VCC: IC2.14(P:VCC) IC3.14(P:VCC) IC5.1(VCC) IC6.1(VCC) IC7.14(P:VCC) IC8.14(P:VCC) IC9.14(P:VCC) IC10.14(P:VCC) IC11.14(P:VCC) IC12.14(P:VCC)
VDD: IC5.16(VDD) IC6.16(VDD)
VIN: U$1.VIN U$2.VIN U$5.VIN
VUSB: U$1.VUSB U$2.VUSB U$5.VUSB
VUSB1: U$1.VUSB1 U$2.VUSB1 U$5.VUSB1

## Library data of the parts
BRIGHTNESS = SparkFun-Resistors:TRIMPOT: Trimming Potentiometer (Trimpot) Three-terminal potentiometers, with an adjustable wiper and two adjustable resistors. A pot can be used to create a configurable voltage divider, or as a variable resistor. "Trimpots" are a subset of potentiometers, usually intended for "set-and-forget" applications. They're often more delicate than standard potentiometers - rated for fewer turns. Variants PTH-KNOB - PTH Trimpot w/ finger-adjustable knob Trimpot 10K with Knob <https://www.sparkfun.com/products/9806> (COM-09806) Datasheet <http://www.sparkfun.com/datasheets/Components/General/TSR-3386.pdf> SMD-3MM-CLOSED-FRAME - SMD 3mm Square Closed-Frame Trimpot Used on e.g. EasyDriver - Stepper Motor Driver <https://www.sparkfun.com/products/12779> Datasheet <http://www.bitechnologies.com/pdfs/22.pdf> (22AR10KTR) SMD-5MM - SMD 5mm Square Closed-Frame Trimpot Used on e.g. IOIO-OTG - V2.2 <https://www.sparkfun.com/products/13613> Datasheet <http://www.vishay.com/docs/51008/ts53.pdf> (TS53YL502MR10) SMD-3MM-1/10W-25% - 3mm Square Open-Frame Trimpot Used on e.g. SparkFun Shapeoko <https://www.sparkfun.com/products/13899> Datasheet <http://www.bourns.com/docs/Product-Datasheets/TC33.pdf> (TC33X-2-103E); PROD_ID: RES-09730; SF_SKU: COM-09806
C1 = SparkFun-Capacitors:1000UF: 1,000µF/1mF ceramic capacitors A capacitor is a passive two-terminal electrical component used to store electrical energy temporarily in an electric field. CAP-08070; PROD_ID: CAP-09538; VALUE: 1mf
C2-C5 = SparkFun-Capacitors:100UF-POLAR: 100µF polarized capacitors A capacitor is a passive two-terminal electrical component used to store electrical energy temporarily in an electric field.; PROD_ID: CAP-08439
C6-C11 C13 C14 = SparkFun-Passives:CAP: Capacitor Standard 0603 ceramic capacitor, and 0.1" leaded capacitor.
D1-D9 D11-D17 = diode:FES08AT: DIODE ultra-fast recovery rectifier
D10 = diode:1N5908: DIODE schottky
IC1 = microchip:PIC18F2*_28: USB Microcontrollers with nanoWatt Technology High-Performance, Enhanced Flash, 28/40/44-Pin, Source: http://ww1.microchip.com/downloads/en/devicedoc/39632c.pdf; MF: MICROCHIP; MPN: PIC18F2550-I/SP; OC_FARNELL: 1523822; OC_NEWARK: 80K6054
IC2 IC7 IC9 IC11 = 74xx-us:74*08: Quad 2-input AND gate
IC3 IC8 IC10 IC12 = 74xx-us:74*04: Hex INVERTER
IC4 = national-semiconductor:LM2596: SIMPLE SWITCHER® Power Converter 150 kHz 3A Step-Down Voltage Regulator Source: http://www.national.com/ds/LM/LM2596.pdf; MPN: LM2596T-ADJ/LF02; OC_FARNELL: 9494162; OC_NEWARK: 65K5910
IC5 IC6 = 45xx:4504: TTL or CMOS to CMOS hex LEVEL SHIFTER
J1 J12-J30 J32 J33 J35 J38 J41 = SparkFun-Connectors:CONN_06: Multi connection point. Often used as Generic Header-pin footprint for 0.1 inch spaced/style header connections On any of the 0.1 inch spaced packages, you can populate with these: Break Away Headers - Straight <https://www.sparkfun.com/products/116> (PRT-00116) Break Away Male Headers - Right Angle <https://www.sparkfun.com/products/553> (PRT-00553) Female Headers <https://www.sparkfun.com/products/115> (PRT-00115) Break Away Headers - Machine Pin <https://www.sparkfun.com/products/117> (PRT-00117) Break Away Female Headers - Swiss Machine Pin <https://www.sparkfun.com/products/743> (PRT-00743) Arduino Stackable Header - 6 Pin <https://www.sparkfun.com/products/9280> (PRT-09280) For SCREWTERMINALS and SPRING TERMINALS visit here: Screw Terimnals on SparkFun.com <https://www.sparkfun.com/search/results?term=Screw+Terminals> (5mm/3.5mm/2.54mm spacing) This device is also useful as a general connection point to wire up your design to another part of your project. Our various solder wires solder well into these plated through hole pads. Hook-Up Wire - Assortment (Stranded, 22 AWG) <https://www.sparkfun.com/products/11375> (PRT-11375) Hook-Up Wire - Assortment (Solid Core, 22 AWG) <https://www.sparkfun.com/products/11367> (PRT-11367) View the entire wire category on our website here <https://www.sparkfun.com/categories/141>
J2-J11 J34 J36 J37 J39 J40 J42 J43 = SparkFun-Connectors:CONN_02: Multi connection point. Often used as Generic Header-pin footprint for 0.1 inch spaced/style header connections On any of the 0.1 inch spaced packages, you can populate with these: Break Away Headers - Straight <https://www.sparkfun.com/products/116> (PRT-00116) Break Away Male Headers - Right Angle <https://www.sparkfun.com/products/553> (PRT-00553) Female Headers <https://www.sparkfun.com/products/115> (PRT-00115) Break Away Headers - Machine Pin <https://www.sparkfun.com/products/117> (PRT-00117) Break Away Female Headers - Swiss Machine Pin <https://www.sparkfun.com/products/743> (PRT-00743) For SCREWTERMINALS and SPRING TERMINALS visit here: Screw Terimnals on SparkFun.com <https://www.sparkfun.com/search/results?term=Screw+Terminals> (5mm/3.5mm/2.54mm spacing) This device is also useful as a general connection point to wire up your design to another part of your project. Our various solder wires solder well into these plated through hole pads. Hook-Up Wire - Assortment (Stranded, 22 AWG) <https://www.sparkfun.com/products/11375> (PRT-11375) Hook-Up Wire - Assortment (Solid Core, 22 AWG) <https://www.sparkfun.com/products/11367> (PRT-11367) View the entire wire category on our website here <https://www.sparkfun.com/categories/141> Special notes: Molex polarized connector foot print use with: PRT-08233 with associated crimp pins and housings. 2.54_SCREWTERM for use with PRT-10571. 3.5mm Screw Terminal footprints for PRT-08084 5mm Screw Terminal footprints for use with PRT-08432; PROD_ID: CONN-08399
J31 = SparkFun-Connectors:CONN_03: Multi connection point. Often used as Generic Header-pin footprint for 0.1 inch spaced/style header connections On any of the 0.1 inch spaced packages, you can populate with these: Break Away Headers - Straight <https://www.sparkfun.com/products/116> (PRT-00116) Break Away Male Headers - Right Angle <https://www.sparkfun.com/products/553> (PRT-00553) Female Headers <https://www.sparkfun.com/products/115> (PRT-00115) Break Away Headers - Machine Pin <https://www.sparkfun.com/products/117> (PRT-00117) Break Away Female Headers - Swiss Machine Pin <https://www.sparkfun.com/products/743> (PRT-00743) Stackable Header - 3 Pin (Female, 0.1") <https://www.sparkfun.com/products/13875> (PRT-13875) For SCREWTERMINALS and SPRING TERMINALS visit here: Screw Terimnals on SparkFun.com <https://www.sparkfun.com/search/results?term=Screw+Terminals> (5mm/3.5mm/2.54mm spacing) This device is also useful as a general connection point to wire up your design to another part of your project. Our various solder wires solder well into these plated through hole pads. Hook-Up Wire - Assortment (Stranded, 22 AWG) <https://www.sparkfun.com/products/11375> (PRT-11375) Hook-Up Wire - Assortment (Solid Core, 22 AWG) <https://www.sparkfun.com/products/11367> (PRT-11367) View the entire wire category on our website here <https://www.sparkfun.com/categories/141> Special notes: Molex polarized connector foot print use with SKU : PRT-08232 with associated crimp pins and housings.
JP1 = SparkFun-RF:XBEE: Digi XBee and XBee Pro XBees are tiny blue chips that can communicate wirelessly with each other. They can do simple things, like replacing a couple of wires in serial communication, which is nice when you want to make a remote for your paintball vehicle. SparkFun Products SparkFun XBee Buying Guide <https://www.sparkfun.com/pages/xbee_guide> SparkFun XBee Explorer USB <https://www.sparkfun.com/products/11812> (WRL-11812) Breakout Board for XBee Module <https://www.sparkfun.com/products/8276> (WRL-8276) SparkFun XBee Explorer Regulated <https://www.sparkfun.com/products/11373> (WRL-11373) SparkFun XBee Explorer Dongle <https://www.sparkfun.com/products/11697> (WRL-11697) SparkFun XBee Shield <https://www.sparkfun.com/products/12847> (WRL-12847) SparkFun XBee Explorer Serial <https://www.sparkfun.com/products/13225> (WRL-13225)
L1 = SparkFun-Passives:INDUCTOR: Inductors Basic Inductor/Choke - 0603 and 1206. Footprints are not proven and vary greatly between part numbers. INDUCTOR POWER 3.3UH 4.0A SMD 0.197" L x 0.197" W x 0.177" H (5.00mm x 5.00mm x 4.50mm)
LCD1 = SparkFun-Displays:LCD-G12864: Graphical LCD 128x64 Graphical LCD 644x128 with LED Backlight. STN Type. KS0108B parallel interface chipset. Datasheet <https://www.sparkfun.com/datasheets/LCD/GDM12864H.pdf> SparkFun Products: Graphic LCD 128x64 <https://www.sparkfun.com/products/710>; SF_ID: LCD-00710
PTC-6A PTC-6A1-PTC-6A3 = ptc-ntc:NTC644A: PHILIPS NTC; OC_FARNELL: unknown; OC_NEWARK: unknown
Q1 Q3 Q12 Q13 Q18 Q19 Q24 Q25 = SparkFun-DiscreteSemi:MOSFET_PCH: P-channel MOSFETs Voltage controlled devices that allow control of high current outputs. SparkFun Products: SparkFun ESP32 Thing <https://www.sparkfun.com/products/13907> SparkFun ESP8266 Thing <https://www.sparkfun.com/products/13231>; PROD_ID: TRANS-13060; VALUE: 24A/20V/50mΩ
Q2 Q4 Q7 Q8 Q16 Q17 Q22 Q23 = SparkFun-DiscreteSemi:MOSFET-NCH: N-channel MOSFETs Voltage controlled devices that allow control of high current outputs. SparkFun Products: SparkFun OpenScale <https://www.sparkfun.com/products/13261> SparkFun Digital Sandbox <https://www.sparkfun.com/products/12651> SparkFun Monster Moto Shield <https://www.sparkfun.com/products/10182> SparkFun MOSFET Power Controller <https://www.sparkfun.com/products/11214>; PROD_ID: TRANS-10060; VALUE: 60V/32A/35mΩ
Q5 Q6 Q9-Q11 Q14 Q15 Q20 Q21 Q26 Q27 = transistor-small-signal:BS170: N-CHANNEL MOS FET
R1-R17 = SparkFun-Passives:RESISTOR: Resistor Basic schematic elements and footprints for 0603, 1206, and PTH resistors.
S1 = switch:M9040P2: TOGGLE SWITCH Marquardt
SW1 SW2 = switch-coto:CT10-XXXX-: CT10 Series Molded Switch Source: www.cotorelay.com .. Coto_Technology__CT10-1530-G1.pdf
U2 = SparkFun-Sensors:LSM9DS1: ST Microelectronics LSM9DS1 9DOF IMU - Accelerometer, Gyroscope & Magnetometer The LSM9DS1 is a versatile, motion-sensing system-in-a-chip. It houses a 3-axis accelerometer, 3-axis gyroscope, and 3-axis magnetometer – nine degrees of freedom (9DOF) in a single IC! The LSM9DS1 is equipped with a digital interface, but even that is flexible: it supports both I2C and SPI, so you’ll be hard-pressed to find a microcontroller it doesn’t work with. Datasheet <https://cdn.sparkfun.com/assets/learn_tutorials/3/7/3/LSM9DS1_Datasheet.pdf> SparkFun Products SparkFun 9 Degrees of Freedom IMU Breakout - LSM9DS1 <https://www.sparkfun.com/products/13284> (SEN-13284) SparkFun Photon IMU Shield <https://www.sparkfun.com/products/13629> (DEV-13629); PROD_ID: IC-12536
U$1 U$2 U$5 = Teensy_3_and_LC_Series_Boards_v1.4:TEENSY_3.6_ALL_PINS&PADS: All pins and pads on the Teensy 3.6 exposed. Assumes the use of multiple, unshrouded headers to get access to the pads on the underside of the Teensy These headers should be a 2x5, 2x4, and a 2x3 with a 0.1" hole spacing / pitch.
U$3 U$4 = SparkFun-AnalogIC:MUX-74HC4067: 16-channel analog MUX; PROD_ID: IC-08252
U$6 U$7 = SparkFun-PowerIC:V_REG_LD1117VXX: LD1117VXX voltage regulator. We carry the 3.3V version (COM-00526) in TO-220 package.
Y1 = SparkFun-FreqCtrl:CRYSTAL: Various standard crystals. Proven footprints.

## Board
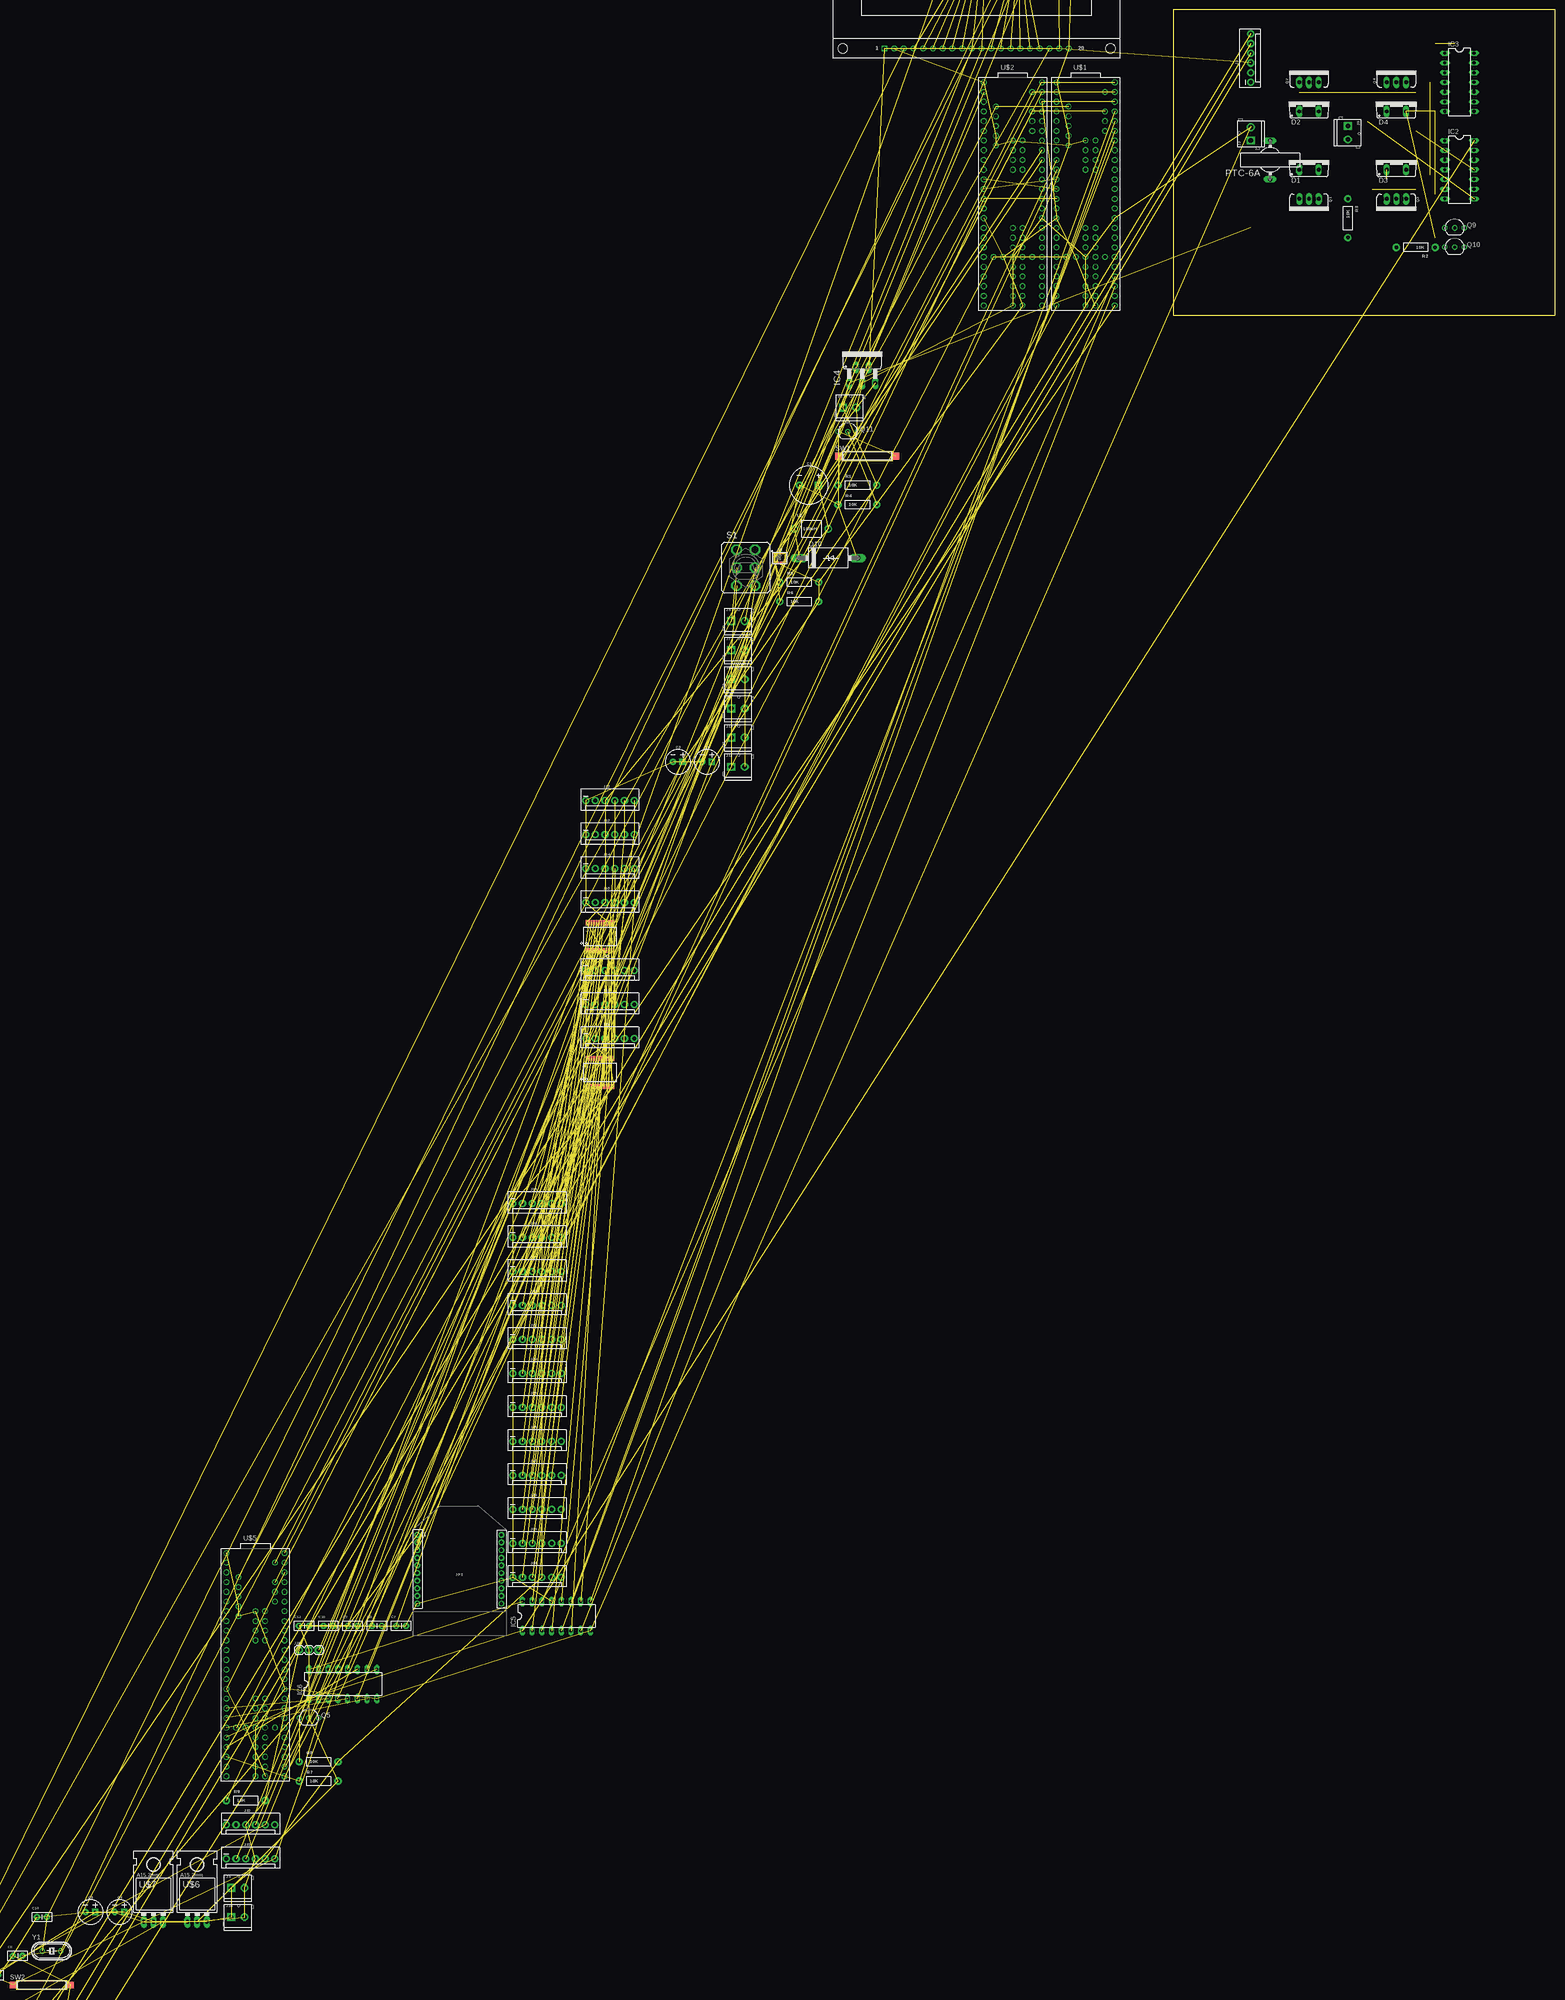
[diagram p5: board, top side]
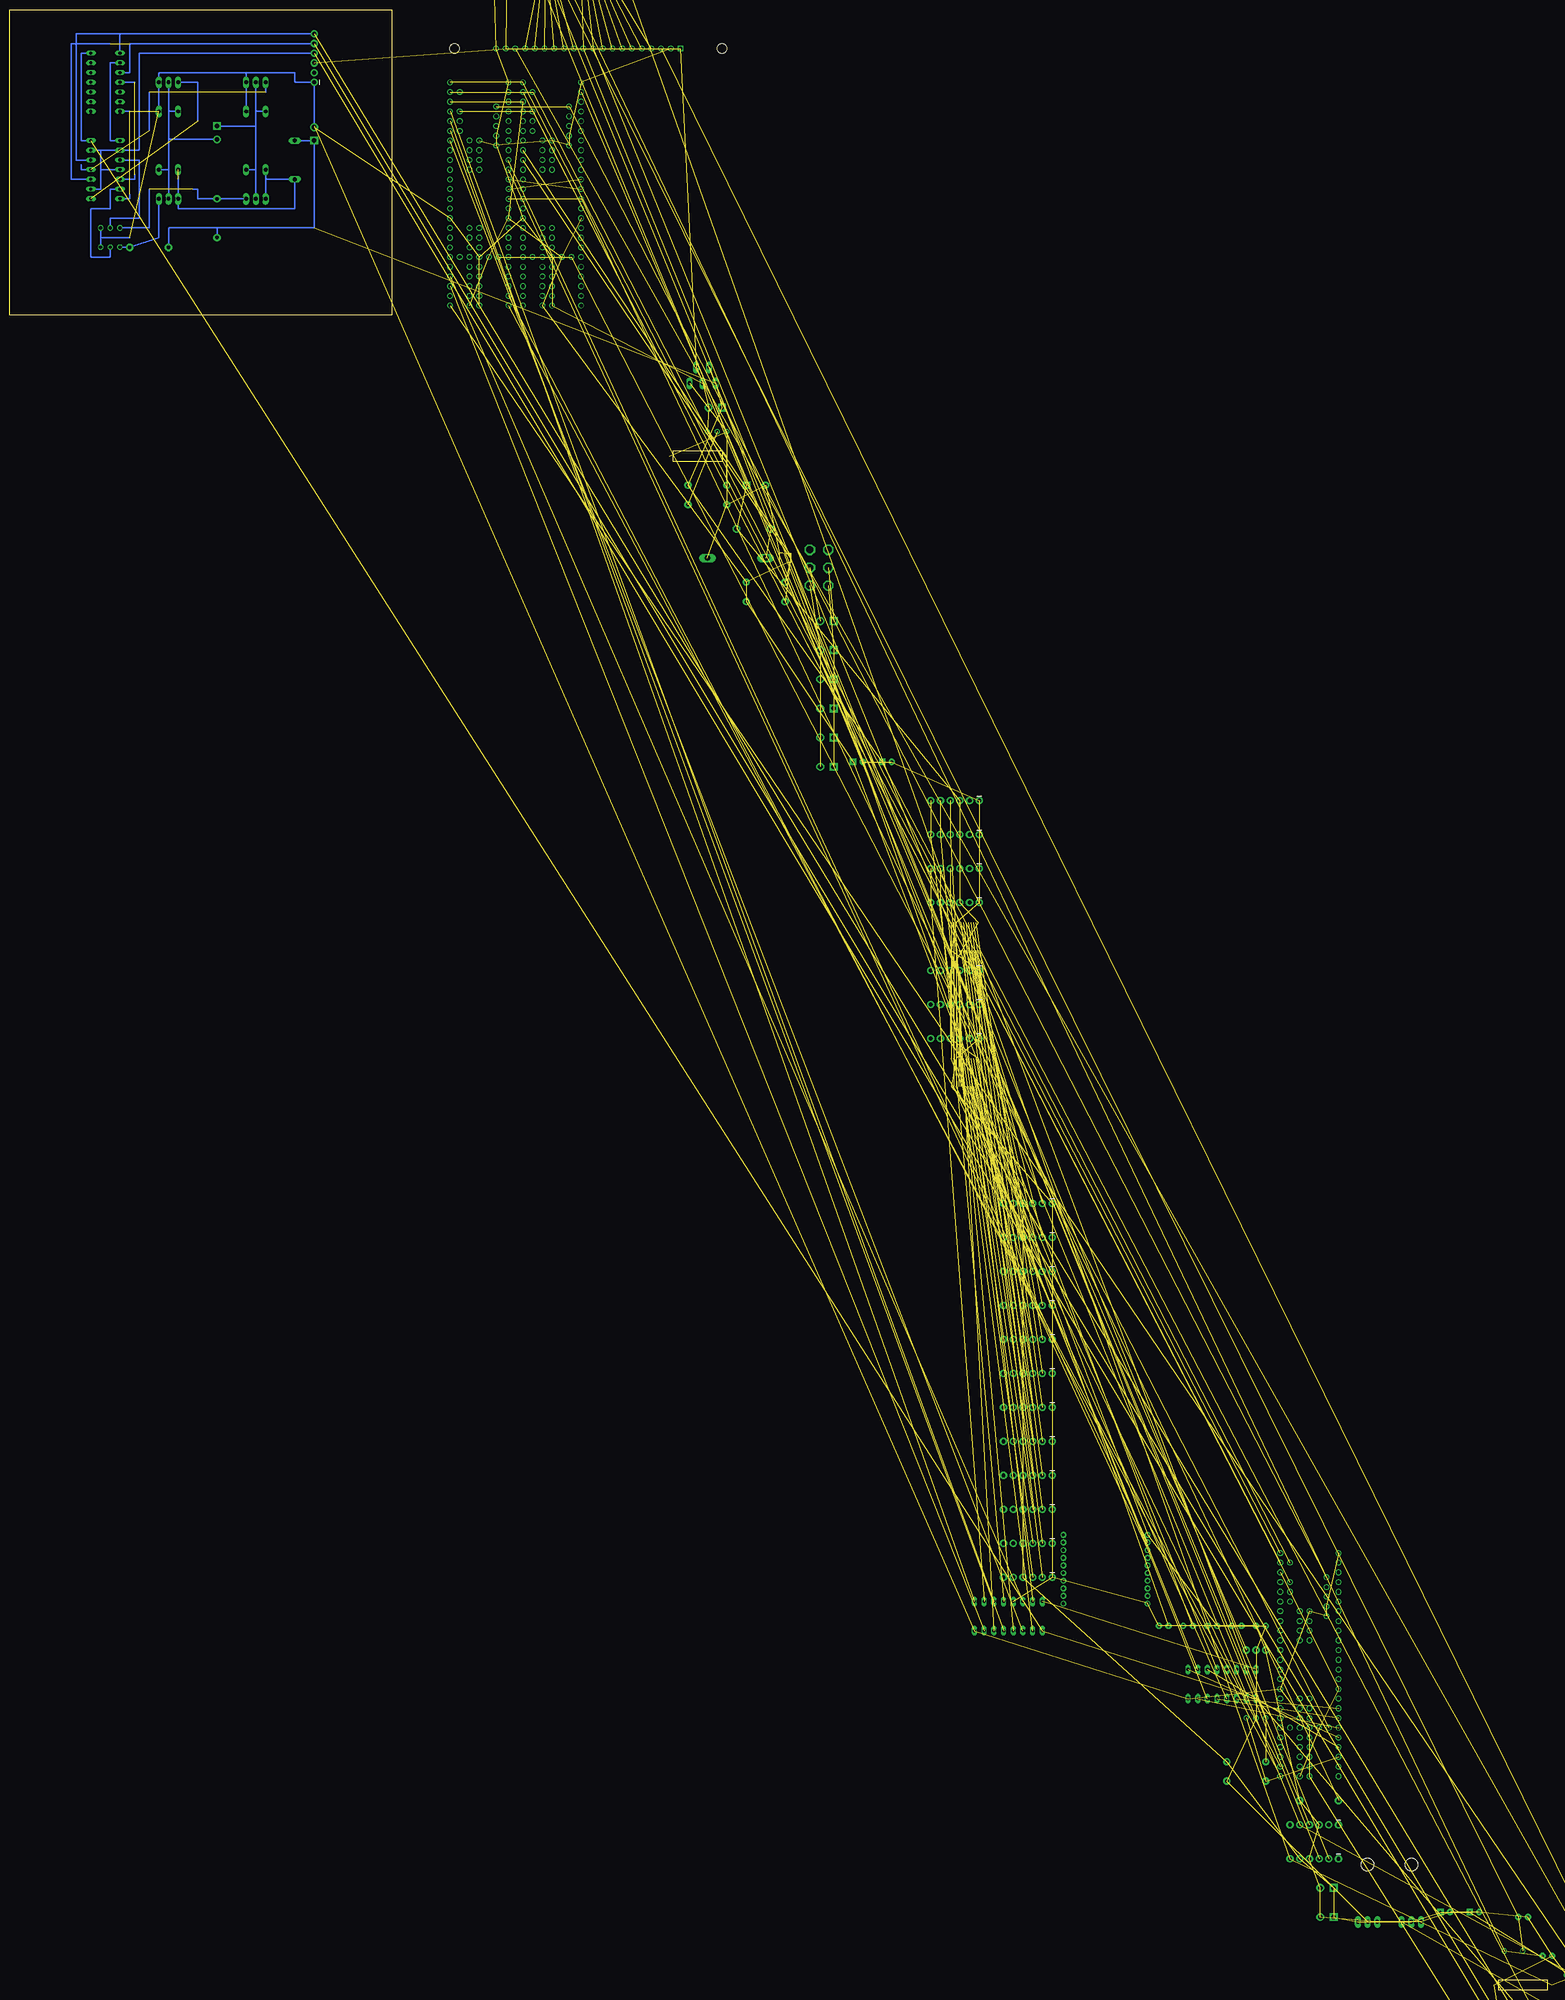
[diagram p6: board, bottom side, seen from below]

Size 100 x 80 mm. Coordinates in mm from the lower left corner, seen from the top.
Outline: 0,0 100,0 100,80 0,80 0,0
Copper layers (1*16): Top 0.035mm / dielectric 1.5mm / Bottom 0.035mm
Design rules "default": minimum track width 10mil, minimum drill 24mil, track to track 8mil, track to pad 8mil, pad to pad 8mil, via to via 8mil, smd to smd 8mil, copper to edge 40mil, drill to drill 8mil, minimum pad ring 10mil, minimum via ring 8mil, stop-mask expansion 4mil, vias tented up to drill 0mil, thermal gap 10mil

### Footprints (pad centres in the part's own frame; a part is rotated, then mirrored left to right if it is on the bottom)
TRIMPOT-PTH-3386U = drill 1.016 pad 1.88 square: 1 -2.54,-0.015 | drill 1.016 pad 1.88: 2 0,-0.015; 3 2.54,-0.015
CPOL-RADIAL-5MM-10MM-KIT = drill 0.9 pad 1.93 square: + 2.5,0 | drill 0.9 pad 1.93: - -2.5,0
CPOL-RADIAL-2.5MM-6.5MM = drill 0.7 pad 1.651 square: 1 1.25,0 | drill 0.7 pad 1.651: 2 -1.25,0
CAP-PTH-SMALLEZ = drill 0.7 pad 1.651: 1 0,0; 2 2.54,0
DO220S = drill 1.016 long: A 2.54,-2.54; C -2.54,-2.54
C4111-15 = drill 1.499 long: A 7.62,0; C -7.62,0
DIL28-3 = drill 0.813 long: 1 -16.51,-3.81; 2 -13.97,-3.81; 3 -11.43,-3.81; 4 -8.89,-3.81; 5 -6.35,-3.81; 6 -3.81,-3.81; 7 -1.27,-3.81; 8 1.27,-3.81; 9 3.81,-3.81; 10 6.35,-3.81; 11 8.89,-3.81; 12 11.43,-3.81; 13 13.97,-3.81; 14 16.51,-3.81; 15 16.51,3.81; 16 13.97,3.81; 17 11.43,3.81; 18 8.89,3.81; 19 6.35,3.81; 20 3.81,3.81; 21 1.27,3.81; 22 -1.27,3.81; 23 -3.81,3.81; 24 -6.35,3.81; 25 -8.89,3.81; 26 -11.43,3.81; 27 -13.97,3.81; 28 -16.51,3.81
DIL14 = drill 0.813 long: 1 -7.62,-3.81; 2 -5.08,-3.81; 3 -2.54,-3.81; 4 0,-3.81; 5 2.54,-3.81; 6 5.08,-3.81; 7 7.62,-3.81; 8 7.62,3.81; 9 5.08,3.81; 10 2.54,3.81; 11 0,3.81; 12 -2.54,3.81; 13 -5.08,3.81; 14 -7.62,3.81
T05D = drill 1.016 long: 1 -3.404,-5.08; 2 -1.702,-0.914; 3 0,-5.08; 4 1.702,-0.914; 5 3.404,-5.08
DIL16 = drill 0.813 long: 1 -8.89,-3.81; 2 -6.35,-3.81; 3 -3.81,-3.81; 4 -1.27,-3.81; 5 1.27,-3.81; 6 3.81,-3.81; 7 6.35,-3.81; 8 8.89,-3.81; 9 8.89,3.81; 10 6.35,3.81; 11 3.81,3.81; 12 1.27,3.81; 13 -1.27,3.81; 14 -3.81,3.81; 15 -6.35,3.81; 16 -8.89,3.81
MOLEX-1X6 = drill 1.016 pad 1.88: 1 0,0; 2 2.54,0; 3 5.08,0; 4 7.62,0; 5 10.16,0; 6 12.7,0
SCREWTERMINAL-3.5MM-2 = drill 1.2 pad 2.032 square: 1 0,0 | drill 1.2 pad 2.032: 2 3.5,0
1X03 = drill 1.016 pad 1.88: 1 0,0; 2 2.54,0; 3 5.08,0
XBEE = drill 0.8 pad 1.524: 1 -11,20; 2 -11,18; 3 -11,16; 4 -11,14; 5 -11,12; 6 -11,10; 7 -11,8; 8 -11,6; 9 -11,4; 10 -11,2; 11 11,2; 12 11,4; 13 11,6; 14 11,8; 15 11,10; 16 11,12; 17 11,14; 18 11,16; 19 11,18; 20 11,20
AXIAL-0.6 = drill 1.2 pad 1.88: P$1 -1.27,0; P$2 7.62,0
LCD-G12864 = drill 1.016 square: 1 13.4,2.5 | drill 1.016: 2 15.94,2.5; 3 18.48,2.5; 4 21.02,2.5; 5 23.56,2.5; 6 26.1,2.5; 7 28.64,2.5; 8 31.18,2.5; 9 33.72,2.5; 10 36.26,2.5; 11 38.8,2.5; 12 41.34,2.5; 13 43.88,2.5; 14 46.42,2.5; 15 48.96,2.5; 16 51.5,2.5; 17 54.04,2.5; 18 56.58,2.5; 19 59.12,2.5; 20 61.66,2.5 | hole 2.5: 2.5,2.5; 2.5,52.2; 72.5,52.2; 72.5,2.5
N644A = drill 1.118 long: 1 -5.08,0; 2 5.08,0
TO220V = drill 1.016 long: 1 -2.54,0; 2 0,0; 3 2.54,0
SOT54E = drill 0.813 octagon: D -2.54,0; G 0,0; S 2.54,0
AXIAL-0.4 = drill 0.9 pad 1.88: P$1 -5.08,0; P$2 5.08,0
M9040P2 = drill 1.803 octagon: 1 -2.413,4.699; 2 -2.413,0; 3 -2.413,-4.699; 4 2.413,4.699; 5 2.413,0; 6 2.413,-4.699
CT10-XXXX-A2 = smd 1.8 x 1.8: 1 -7.5,0; 2 7.5,0
LGA-24-3.5X3 = smd 0.27 x 0.45: 1 -1.505,1.225; 6 -1.505,-1.225; 7 -1.075,-1.225; 8 -0.645,-1.225; 9 -0.215,-1.225; 10 0.215,-1.225; 11 0.645,-1.225; 12 1.075,-1.225; 13 1.505,-1.225; 18 1.505,1.225; 19 1.075,1.225; 20 0.645,1.225; 21 0.215,1.225; 22 -0.215,1.225; 23 -0.645,1.225; 24 -1.075,1.225 | smd 0.45 x 0.27: 2 -1.475,0.645; 3 -1.475,0.215; 4 -1.475,-0.215; 5 -1.475,-0.645; 14 1.475,-0.645; 15 1.475,-0.215; 16 1.475,0.215; 17 1.475,0.645
TEENSY_3.6_ALL_PINS&PADS = drill 0.965: 0 -7.62,26.67; 1 -7.62,24.13; 2 -7.62,21.59; 3 -7.62,19.05; 3.3V 7.62,24.13; 3.3V2 2.54,-29.21; 3.3V3 -7.62,-6.35; 3.3V4 -2.54,-16.51; 4 -7.62,16.51; 5 -7.62,13.97; 6 -7.62,11.43; 7 -7.62,8.89; 8 -7.62,6.35; 9 -7.62,3.81; 10 -7.62,1.27; 11 -7.62,-1.27; 12 -7.62,-3.81; 13 7.62,-3.81; 14/A0 7.62,-1.27; 15/A1 7.62,1.27; 16/A2 7.62,3.81; 17/A3 7.62,6.35; 18/A4 7.62,8.89; 19/A5 7.62,11.43; 20/A6 7.62,13.97; 21/A7 7.62,16.51; 22/A8 7.62,19.05; 23/A9 7.62,21.59; 24 -7.62,-8.89; 25 -7.62,-11.43; 26 -7.62,-13.97; 27 -7.62,-16.51; 28 -7.62,-19.05; 29 -7.62,-21.59; 30 -7.62,-24.13; 31/A12 -7.62,-26.67; 32/A13 -7.62,-29.21; 33/A14 7.62,-29.21; 34/A15 7.62,-26.67; 35/A16 7.62,-24.13; 36/A17 7.62,-21.59; 37/A18 7.62,-19.05; 38/A19 7.62,-16.51; 39/A20 7.62,-13.97; 40 0,-8.89; 41 0,-11.43; 42 0,-13.97; 43 0,-19.05; 44 0,-21.59; 45 0,-24.13; 46 0,-26.67; 47 2.54,-26.67; 48 2.54,-24.13; 49 2.54,-21.59; 50 2.54,-19.05; 51 2.54,-13.97; 52 2.54,-11.43; 53 2.54,-8.89; 54 2.54,6.35; 55 2.54,8.89; 56 2.54,11.43; 57 2.54,13.97; A10 5.08,19.05; A11 5.08,16.51; A21 7.62,-11.43; A22 7.62,-8.89; AGND 7.62,26.67; AREF 5.08,21.59; D+ -4.445,17.78; D- -4.445,20.32; DC 0,8.89; DE 0,11.43; DO 0,6.35; GND -7.62,29.21; GND1 7.62,-6.35; GND2 0,13.97; GND3 -4.445,15.24; GND4 -4.445,12.7; GND5 0,-29.21; GND6 0,-16.51; PGM 2.54,-16.51; RESET 5.08,-16.51; VBAT -5.08,-16.51; VIN 7.62,29.21; VUSB 5.08,26.67; VUSB1 -4.445,22.86
SSOP24 = smd 0.348 x 1.397: 1 -3.575,-3.656; 2 -2.925,-3.656; 3 -2.275,-3.656; 4 -1.625,-3.656; 5 -0.975,-3.656; 6 -0.325,-3.656; 7 0.325,-3.656; 8 0.975,-3.656; 9 1.625,-3.656; 10 2.275,-3.656; 11 2.925,-3.656; 12 3.575,-3.656; 13 3.575,3.656; 14 2.925,3.656; 15 2.275,3.656; 16 1.625,3.656; 17 0.975,3.656; 18 0.325,3.656; 19 -0.325,3.656; 20 -0.975,3.656; 21 -1.625,3.656; 22 -2.275,3.656; 23 -2.925,3.656; 24 -3.575,3.656
78XXL = drill 1.016 long: GND 0,-3.81; IN -2.54,-3.81; OUT 2.54,-3.81 | hole 3.302: 0,11.176
HC49U-V = drill 0.813: 1 -2.413,0; 2 2.413,0

### Placement (x,y rotation side)
BRIGHTNESS  -317.5,-431.8 0 top  (outside the outline)
C1  -95.25,-44.45 0 top  (outside the outline)
C2  -121.92,-116.84 0 top  (outside the outline)
C3  -129.54,-116.84 0 top  (outside the outline)
C4  -275.59,-417.83 0 top  (outside the outline)
C5  -283.21,-417.83 0 top  (outside the outline)
C6  -303.53,-429.26 0 top  (outside the outline)
C7  -203.2,-342.9 0 top  (outside the outline)
C8  -209.55,-342.9 0 top  (outside the outline)
C9  -215.9,-342.9 0 top  (outside the outline)
C10  -222.25,-342.9 0 top  (outside the outline)
C11  -228.6,-342.9 0 top  (outside the outline)
C13  -297.18,-419.1 0 top  (outside the outline)
C14  -309.88,-434.34 0 top  (outside the outline)
D1  35.56,40.64 0 top
D2  35.56,55.88 0 top
D3  58.42,40.64 0 top
D4  58.42,55.88 0 top
D5  -295.91,-476.25 0 top  (outside the outline)
D6  -284.48,-476.25 0 top  (outside the outline)
D7  -316.23,-488.95 0 top  (outside the outline)
D8  -304.8,-488.95 0 top  (outside the outline)
D9  -316.23,-552.45 0 top  (outside the outline)
D10  -90.17,-63.5 0 top  (outside the outline)
D11  -304.8,-552.45 0 top  (outside the outline)
D12  -293.37,-552.45 0 top  (outside the outline)
D13  -281.94,-552.45 0 top  (outside the outline)
D14  -270.51,-552.45 0 top  (outside the outline)
D15  -316.23,-562.61 0 top  (outside the outline)
D16  -304.8,-562.61 0 top  (outside the outline)
D17  -293.37,-562.61 0 top  (outside the outline)
IC1  -31.75,128.27 0 top  (outside the outline)
IC2  74.93,38.1 270 top
IC3  74.93,60.96 270 top
IC4  -81.28,-12.7 0 top  (outside the outline)
IC5  -161.29,-340.36 0 top  (outside the outline)
IC6  -217.17,-358.14 0 top  (outside the outline)
IC7  -298.45,-459.74 0 top  (outside the outline)
IC8  -311.15,-481.33 0 top  (outside the outline)
IC9  -285.75,-523.24 0 top  (outside the outline)
IC10  -311.15,-544.83 0 top  (outside the outline)
IC11  -290.83,-544.83 0 top  (outside the outline)
IC12  -270.51,-544.83 0 top  (outside the outline)
J1  20.32,60.96 90 top
J2  20.32,45.72 90 top
J3  45.72,49.53 270 top
J4  -246.38,-411.48 0 top  (outside the outline)
J5  -86.36,-24.13 0 top  (outside the outline)
J6  -115.57,-80.01 0 top  (outside the outline)
J7  -115.57,-87.63 0 top  (outside the outline)
J8  -115.57,-95.25 0 top  (outside the outline)
J9  -115.57,-102.87 0 top  (outside the outline)
J10  -115.57,-110.49 0 top  (outside the outline)
J11  -115.57,-118.11 0 top  (outside the outline)
J12  -153.67,-127 0 top  (outside the outline)
J13  -153.67,-135.89 0 top  (outside the outline)
J14  -153.67,-144.78 0 top  (outside the outline)
J15  -153.67,-153.67 0 top  (outside the outline)
J16  -153.67,-171.45 0 top  (outside the outline)
J17  -153.67,-180.34 0 top  (outside the outline)
J18  -153.67,-189.23 0 top  (outside the outline)
J19  -172.72,-232.41 0 top  (outside the outline)
J20  -172.72,-241.3 0 top  (outside the outline)
J21  -172.72,-250.19 0 top  (outside the outline)
J22  -172.72,-259.08 0 top  (outside the outline)
J23  -172.72,-267.97 0 top  (outside the outline)
J24  -172.72,-276.86 0 top  (outside the outline)
J25  -172.72,-285.75 0 top  (outside the outline)
J26  -172.72,-294.64 0 top  (outside the outline)
J27  -172.72,-303.53 0 top  (outside the outline)
J28  -172.72,-312.42 0 top  (outside the outline)
J29  -172.72,-321.31 0 top  (outside the outline)
J30  -172.72,-330.2 0 top  (outside the outline)
J31  -228.6,-349.25 0 top  (outside the outline)
J32  -247.65,-394.97 0 top  (outside the outline)
J33  -247.65,-403.86 0 top  (outside the outline)
J34  -246.38,-419.1 0 top  (outside the outline)
J35  -297.18,-491.49 0 top  (outside the outline)
J36  -318.77,-501.65 0 top  (outside the outline)
J37  -309.88,-501.65 0 top  (outside the outline)
J38  -285.75,-565.15 0 top  (outside the outline)
J39  -303.53,-575.31 0 top  (outside the outline)
J40  -294.64,-575.31 0 top  (outside the outline)
J41  -320.04,-575.31 0 top  (outside the outline)
J42  -285.75,-575.31 0 top  (outside the outline)
J43  -276.86,-575.31 0 top  (outside the outline)
JP1  -186.69,-339.09 0 top  (outside the outline)
L1  -97.79,-55.88 0 top  (outside the outline)
LCD1  -88.9,67.31 0 top  (outside the outline)
PTC-6A  25.4,40.64 90 top
PTC-6A1  -316.23,-467.36 0 top  (outside the outline)
PTC-6A2  -316.23,-530.86 0 top  (outside the outline)
PTC-6A3  -303.53,-530.86 0 top  (outside the outline)
Q1  35.56,30.48 180 top
Q2  35.56,60.96 0 top
Q3  58.42,30.48 180 top
Q4  58.42,60.96 0 top
Q5  -226.06,-367.03 0 top  (outside the outline)
Q6  -318.77,-440.69 0 top  (outside the outline)
Q7  -297.18,-500.38 0 top  (outside the outline)
Q8  -284.48,-500.38 0 top  (outside the outline)
Q9  73.66,22.86 0 top
Q10  73.66,17.78 0 top
Q11  -85.09,-30.48 0 top  (outside the outline)
Q12  -314.96,-509.27 0 top  (outside the outline)
Q13  -302.26,-509.27 0 top  (outside the outline)
Q14  -292.1,-508 0 top  (outside the outline)
Q15  -318.77,-514.35 0 top  (outside the outline)
Q16  -314.96,-582.93 0 top  (outside the outline)
Q17  -302.26,-582.93 0 top  (outside the outline)
Q18  -314.96,-589.28 0 top  (outside the outline)
Q19  -302.26,-589.28 0 top  (outside the outline)
Q20  -266.7,-588.01 0 top  (outside the outline)
Q21  -318.77,-594.36 0 top  (outside the outline)
Q22  -289.56,-582.93 0 top  (outside the outline)
Q23  -276.86,-582.93 0 top  (outside the outline)
Q24  -289.56,-589.28 0 top  (outside the outline)
Q25  -276.86,-589.28 0 top  (outside the outline)
Q26  -306.07,-594.36 0 top  (outside the outline)
Q27  -293.37,-594.36 0 top  (outside the outline)
R1  -82.55,-44.45 0 top  (outside the outline)
R2  63.5,17.78 180 top
R3  45.72,25.4 270 top
R4  -82.55,-49.53 0 top  (outside the outline)
R5  -97.79,-69.85 0 top  (outside the outline)
R6  -97.79,-74.93 0 top  (outside the outline)
R7  -223.52,-383.54 0 top  (outside the outline)
R8  -223.52,-378.46 0 top  (outside the outline)
R9  -242.57,-388.62 0 top  (outside the outline)
R10  -316.23,-447.04 0 top  (outside the outline)
R11  -316.23,-452.12 0 top  (outside the outline)
R12  -303.53,-515.62 0 top  (outside the outline)
R13  -290.83,-515.62 0 top  (outside the outline)
R14  -278.13,-595.63 0 top  (outside the outline)
R15  -265.43,-595.63 0 top  (outside the outline)
R16  -316.23,-600.71 0 top  (outside the outline)
R17  -303.53,-600.71 0 top  (outside the outline)
S1  -111.76,-66.04 0 top  (outside the outline)
SW1  -80.01,-36.83 0 top  (outside the outline)
SW2  -295.91,-436.88 0 top  (outside the outline)
U2  -102.87,-63.5 0 top  (outside the outline)
U$1  -22.86,31.75 0 top  (outside the outline)
U$2  -41.91,31.75 0 top  (outside the outline)
U$3  -149.86,-162.56 0 top  (outside the outline)
U$4  -149.86,-198.12 0 top  (outside the outline)
U$5  -240.03,-353.06 0 top  (outside the outline)
U$6  -255.27,-416.56 0 top  (outside the outline)
U$7  -266.7,-416.56 0 top  (outside the outline)
Y1  -293.37,-427.99 0 top  (outside the outline)

### Tracks (layer width: path | path; a pad name or v marks a point on that pad's centre or on a via)
3.3V  (3 unrouted)
+3V3  (31 unrouted)
+5V  (38 unrouted)
+12V  (16 unrouted)
  Bottom 0.406: PTC-6A.2 J2.1 20.32,22.86 45.72,22.86 | R3.P$2 45.72,22.86 | 45.72,22.86 58.42,22.86 R2.P$2
AGND  (2 unrouted)
AREF  (2 unrouted)
ECHO  (2 unrouted)
GND  (91 unrouted)
  Bottom 0.406: 76.2,20.32 Q10.S | Q9.S 76.2,20.32 | 76.2,20.32 68.58,20.32 | J2.2 J1.1 25.4,60.96 25.4,63.5 60.96,63.5 60.96,53.34
IN1  (9 unrouted)
  Bottom 0.406: J1.6 71.12,73.66 | 71.12,73.66 IC3.1 | IC2.12 82.55,40.64 82.55,73.66 71.12,73.66
IN2  (10 unrouted)
  Bottom 0.406: J1.5 68.58,71.12 68.58,63.5 IC3.3 | IC2.10 83.82,35.56 83.82,71.12 73.66,71.12
LCD-DATA  (3 unrouted)
N$1
  Bottom 0.406: Q9.G 73.66,25.4 66.04,25.4 66.04,40.64 IC2.3
N$2
  Bottom 0.406: Q10.G 73.66,15.24 78.74,15.24 78.74,27.94 73.66,27.94 73.66,33.02 IC2.6
N$3  (2 unrouted)
N$4  (1 unrouted)
N$6  (1 unrouted)
N$7  (1 unrouted)
N$8  (1 unrouted)
N$9  (3 unrouted)
N$11  (2 unrouted)
N$12  (1 unrouted)
N$13  (2 unrouted)
N$14  (2 unrouted)
N$15  (1 unrouted)
N$16  (1 unrouted)
N$18  (1 unrouted)
N$19  (1 unrouted)
N$20  (5 unrouted)
N$21  (2 unrouted)
N$22  (1 unrouted)
N$23  (1 unrouted)
N$24  (1 unrouted)
N$25  (1 unrouted)
N$26  (1 unrouted)
N$27  (1 unrouted)
N$28  (1 unrouted)
N$29  (1 unrouted)
N$30  (1 unrouted)
N$31  (2 unrouted)
N$32  (2 unrouted)
N$33  (1 unrouted)
N$34  (1 unrouted)
N$35  (1 unrouted)
N$36
  Bottom 0.406: J3.1 35.56,49.53 | 35.56,38.1 Q1.2 | 35.56,53.34 Q2.2 | D2.C 35.56,53.34 | 35.56,53.34 35.56,49.53 | D1.A 35.56,38.1 | 35.56,38.1 35.56,49.53
N$37
  Bottom 0.406: D4.C 58.42,53.34 | 58.42,53.34 Q4.2 | Q3.2 58.42,38.1 | 58.42,38.1 58.42,45.72 58.42,46.03 | 58.42,46.03 58.42,53.34 | D3.A 58.42,38.1 | J3.2 58.42,46.03
N$38  (2 unrouted)
  Bottom 0.406: 33.02,35.56 Q1.3 | 33.02,35.56 PTC-6A.1 25.4,27.94 55.88,27.94 Q3.3 D3.C | 33.02,35.56 D1.C
N$39  (2 unrouted)
  Bottom 0.406: Q2.1 33.02,58.42 | 63.5,48.26 63.5,58.42 | IC2.11 81.28,38.1 81.28,39.37
N$40
  Bottom 0.406: Q3.1 60.96,20.32 R2.P$1 Q10.D
N$41  (29 unrouted)
  Bottom 0.406: 38.1,63.5 60.96,63.5 Q4.3 D4.A | 38.1,63.5 Q2.3 D2.A | 68.58,53.34 IC3.7 | 38.1,63.5 25.4,63.5 25.4,60.96 20.32,60.96 20.32,49.53 | IC2.7 68.58,30.48 68.58,31.75
N$42  (1 unrouted)
  Bottom 0.406: Q4.1 50.8,60.96 50.8,50.8
N$43  (1 unrouted)
  Bottom 0.406: Q1.1 R3.P$1 50.8,30.48 50.8,33.02 52.07,33.02 | Q9.D 63.5,22.86 63.5,33.02
N$44  (5 unrouted)
N$45  (1 unrouted)
N$46  (1 unrouted)
N$47  (1 unrouted)
N$48  (2 unrouted)
N$49  (4 unrouted)
N$50
  Bottom 0.406: IC3.2 73.66,66.04 73.66,45.72 IC2.1
N$51  (1 unrouted)
  Bottom 0.406: IC3.4 67.31,60.96 | IC2.5 67.31,35.56 67.31,36.83
N$52  (1 unrouted)
N$53  (2 unrouted)
N$54  (2 unrouted)
N$55  (2 unrouted)
N$56  (2 unrouted)
N$57  (1 unrouted)
N$58  (1 unrouted)
N$59  (1 unrouted)
N$60  (1 unrouted)
N$61  (1 unrouted)
N$62  (1 unrouted)
N$63  (1 unrouted)
N$64  (1 unrouted)
N$65  (1 unrouted)
N$66  (1 unrouted)
N$67  (1 unrouted)
N$68  (1 unrouted)
N$69  (1 unrouted)
N$70  (1 unrouted)
N$71  (1 unrouted)
N$72  (1 unrouted)
N$73  (1 unrouted)
N$74  (1 unrouted)
N$75  (1 unrouted)
N$76  (1 unrouted)
N$77  (1 unrouted)
N$78  (2 unrouted)
N$79  (1 unrouted)
N$80  (1 unrouted)
N$81  (1 unrouted)
N$82  (1 unrouted)
N$83  (2 unrouted)
N$84  (1 unrouted)
N$85  (1 unrouted)
N$86  (2 unrouted)
N$87  (2 unrouted)
N$88  (1 unrouted)
N$89  (2 unrouted)
N$90  (1 unrouted)
N$91  (1 unrouted)
N$92  (1 unrouted)
N$93  (1 unrouted)
N$94  (1 unrouted)
N$95  (1 unrouted)
N$96  (1 unrouted)
N$97  (1 unrouted)
N$99  (1 unrouted)
N$100  (1 unrouted)
N$101  (1 unrouted)
N$102  (4 unrouted)
N$103  (2 unrouted)
N$104  (4 unrouted)
N$105  (3 unrouted)
N$106  (2 unrouted)
N$107  (1 unrouted)
N$108  (2 unrouted)
N$109  (2 unrouted)
N$110  (1 unrouted)
N$111  (1 unrouted)
N$112  (1 unrouted)
N$113  (1 unrouted)
N$114  (1 unrouted)
N$115  (1 unrouted)
N$117  (4 unrouted)
N$118  (4 unrouted)
N$119  (4 unrouted)
N$120  (2 unrouted)
N$121  (2 unrouted)
N$122  (1 unrouted)
N$123  (1 unrouted)
N$124  (1 unrouted)
N$125  (1 unrouted)
N$126  (1 unrouted)
N$127  (1 unrouted)
N$129  (4 unrouted)
N$130  (4 unrouted)
N$131  (4 unrouted)
N$132  (2 unrouted)
N$133  (2 unrouted)
N$134  (1 unrouted)
N$135  (1 unrouted)
N$136  (1 unrouted)
N$137  (1 unrouted)
N$138  (1 unrouted)
N$139  (1 unrouted)
N$141  (1 unrouted)
PROXIMITY_DATA  (1 unrouted)
PWM  (15 unrouted)
  Bottom 0.406: J1.4 66.04,68.58 66.04,43.18 IC2.2 76.2,43.18 | IC2.13 76.2,43.18 | IC2.9 76.2,33.02 76.2,38.1 | 76.2,38.1 76.2,43.18 | IC2.4 76.2,38.1
SENSOR_FUSION_DATA  (1 unrouted)
SENSOR_FUSION_REQUEST  (2 unrouted)
TRIG  (1 unrouted)
VBAT  (2 unrouted)
VCC  (8 unrouted)
  Bottom 0.406: IC2.14 81.28,45.72 81.28,68.58 IC3.14
VDD  (1 unrouted)
VIN  (2 unrouted)
VUSB  (2 unrouted)
VUSB1  (2 unrouted)